# EAGLE design OBCv4.21 (EAGLE 9.6.2)

## Sheet 1 of 3
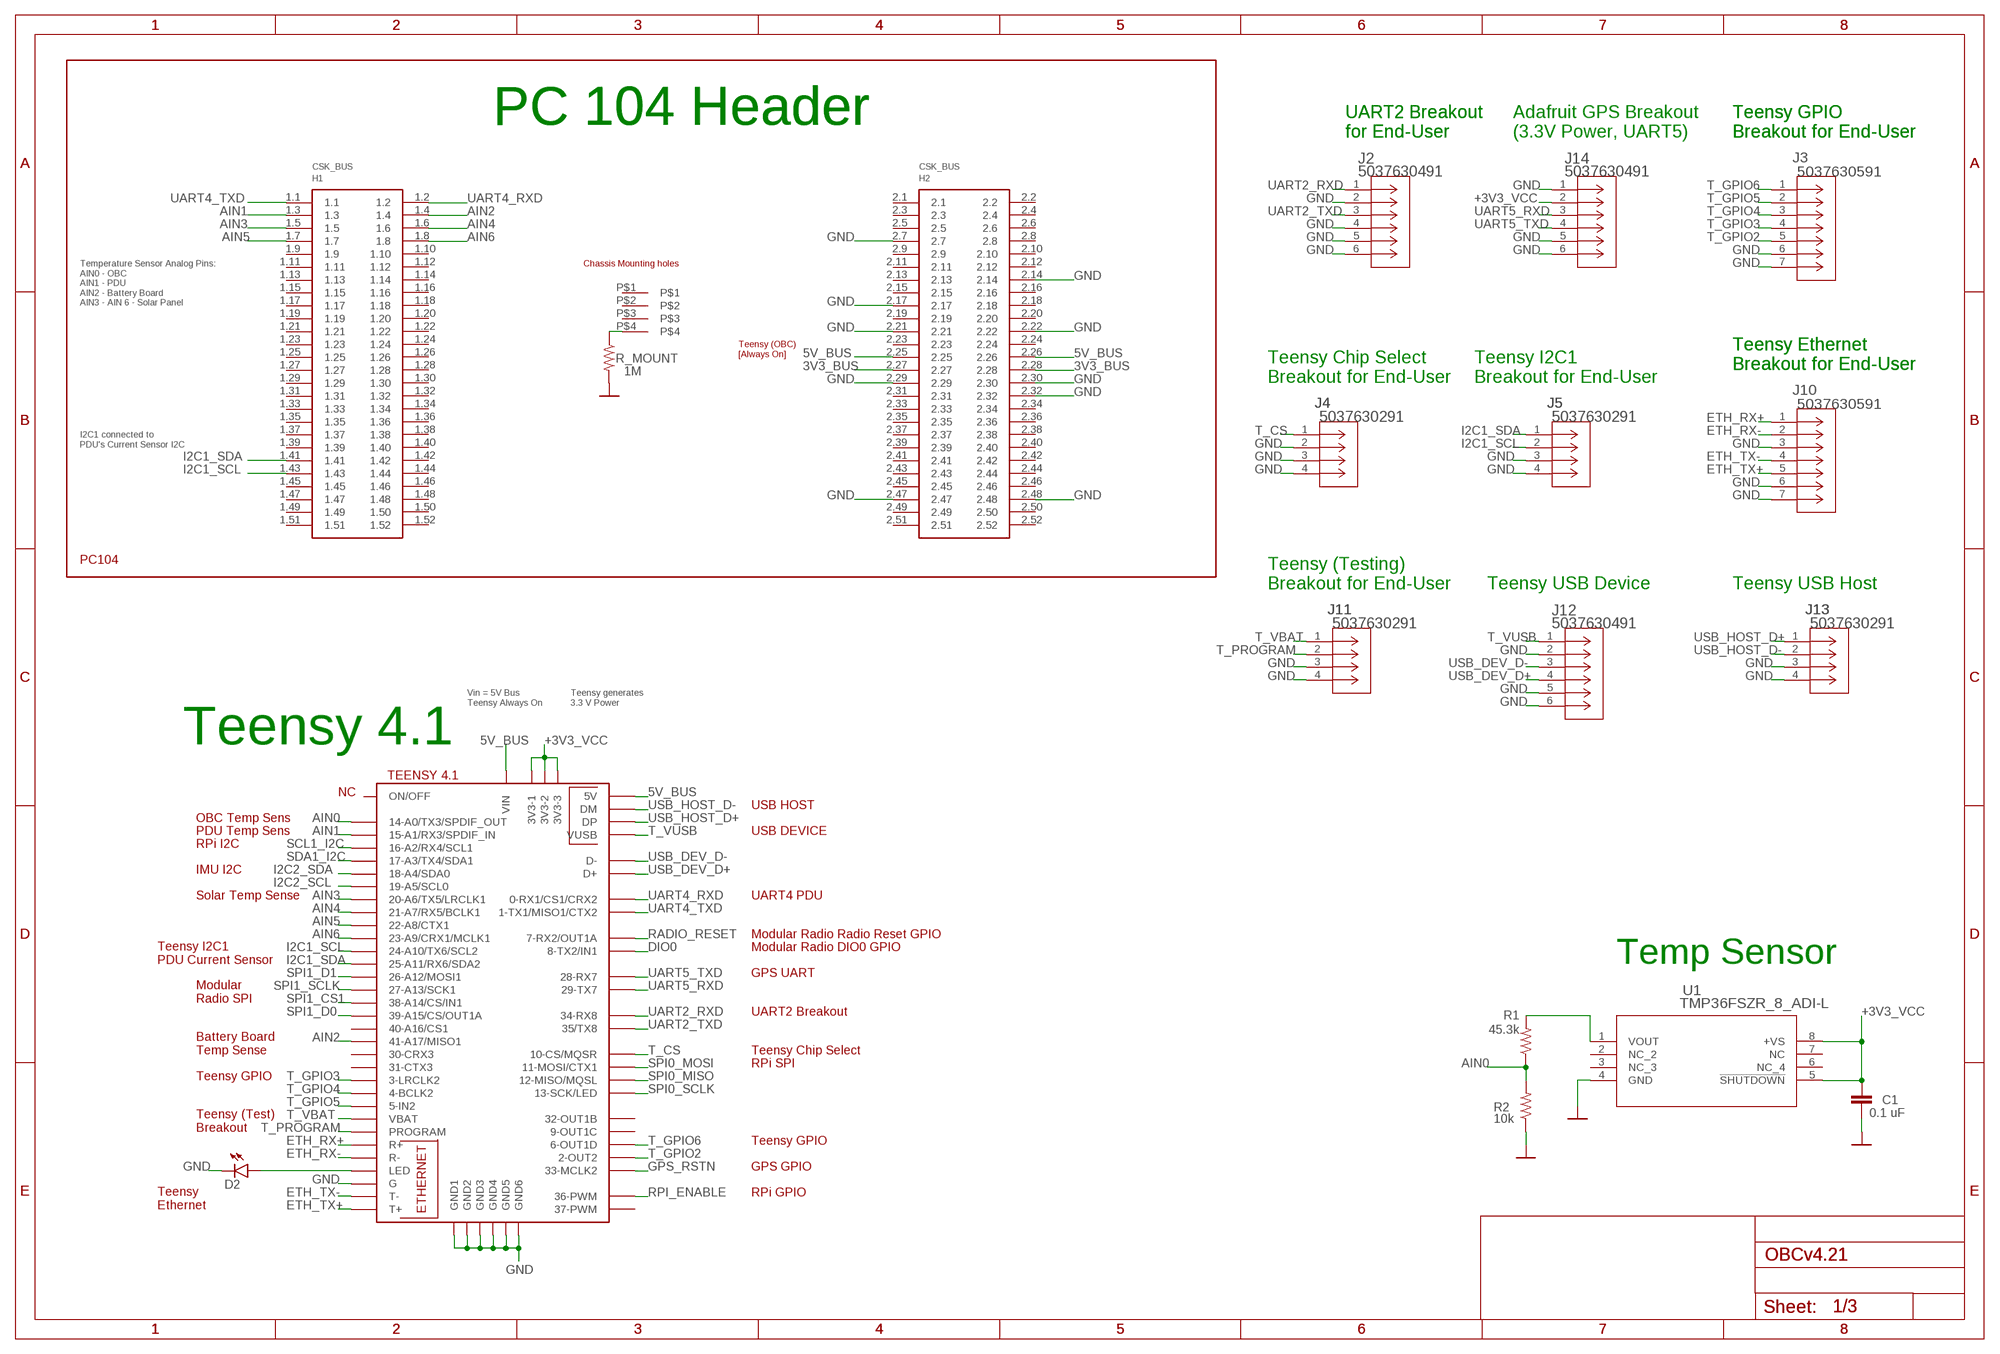
[diagram p0: schematic, sheet 1]

### Parts
C1  0.1 uF  CAP0805  [0805]
D2  LEDCHIP-LED0603  [CHIP-LED0603]
H1  PC104_WCONN  [PC104_WCONN]
J2  5037630491  [CON_5037630491]
J3  5037630591  [CON_5037630591]
J4  5037630291  [CON_5037630291]
J5  5037630291  [CON_5037630291]
J10  5037630591  [CON_5037630591]
J11  5037630291  [CON_5037630291]
J12  5037630491  [CON_5037630491]
J13  5037630291  [CON_5037630291]
J14  5037630491  [CON_5037630491]
R1  45.3k  RESISTOR0805-RES  [0805]
R2  10k  RESISTOR0805-RES  [0805]
R_MOUNT  1M  RESISTOR0805-RES  [0805]
U1  TMP36FSZR_8_ADI-L  [R_8_ADI-L]
U$1  TEENSY41  [TEENSY41]

### Nets
3V3_BUS: H1.2.27 H1.2.28 ; also sheet 3
5V_BUS: H1.2.25 H1.2.26 U$1.+5V(5V) U$1.VIN ; also sheet 2
+3V3_VCC: C1.1 J14.2 U1.5(!SHUTDOWN) U1.8(+VS) U$1.3V3-1 U$1.3V3-2 U$1.3V3-3 ; also sheet 3
AIN0: R1.1 R2.2 U$1.14-A0/TX3/SPDIF_OUT
AIN1: H1.1.3 U$1.15-A1/RX3/SPDIF_IN
AIN2: H1.1.4 U$1.41-A17/MISO1
AIN3: H1.1.5 U$1.20-A6/TX5/LRCLK1
AIN4: H1.1.6 U$1.21-A7/RX5/BCLK1
AIN5: H1.1.7 U$1.22-A8/CTX1
AIN6: H1.1.8 U$1.23-A9/CRX1/MCLK1
DIO0: U$1.8-TX2/IN1 ; also sheet 3
ETH_RX+: J10.1 U$1.R+
ETH_RX-: J10.2 U$1.R-
ETH_TX+: J10.5 U$1.T+
ETH_TX-: J10.4 U$1.T-
GND: C1.2 D2.C H1.2.7 H1.2.14 H1.2.17 H1.2.21 H1.2.22 H1.2.29 H1.2.30 H1.2.32 H1.2.47 H1.2.48 J2.2 J2.4 J2.5 J2.6 J3.6 J3.7 J4.2 J4.3 J4.4 J5.3 J5.4 J10.3 J10.6 J10.7 J11.3 J11.4 J12.2 J12.5 J12.6 J13.3 J13.4 J14.1 J14.5 J14.6 R2.1 R_MOUNT.2 U1.4(GND) U$1.G U$1.GND1 U$1.GND2 U$1.GND3 U$1.GND4 U$1.GND5 U$1.GND6 ; also sheet 2,3
GPS_RSTN: U$1.33-MCLK2 ; also sheet 3
I2C1_SCL: H1.1.43 J5.2 U$1.24-A10/TX6/SCL2
I2C1_SDA: H1.1.41 J5.1 U$1.25-A11/RX6/SDA2
I2C2_SCL: U$1.19-A5/SCL0 ; also sheet 3
I2C2_SDA: U$1.18-A4/SDA0 ; also sheet 3
N$8: D2.A U$1.LED
N$15: R1.2 U1.1(VOUT)
N$94: H1.P$4 R_MOUNT.1
RADIO_RESET: U$1.7-RX2/OUT1A ; also sheet 3
RPI_ENABLE: U$1.36-PWM ; also sheet 2
SCL1_I2C: U$1.16-A2/RX4/SCL1 ; also sheet 2
SDA1_I2C: U$1.17-A3/TX4/SDA1 ; also sheet 2
SPI0_MISO: U$1.12-MISO/MQSL ; also sheet 2
SPI0_MOSI: U$1.11-MOSI/CTX1 ; also sheet 2
SPI0_SCLK: U$1.13-SCK/LED ; also sheet 2
SPI1_CS1: U$1.38-A14/CS/IN1 ; also sheet 3
SPI1_D0: U$1.39-A15/CS/OUT1A ; also sheet 3
SPI1_D1: U$1.26-A12/MOSI1 ; also sheet 3
SPI1_SCLK: U$1.27-A13/SCK1 ; also sheet 3
T_CS: J4.1 U$1.10-CS\MQSR(10-CS/MQSR)
T_GPIO2: J3.5 U$1.2-OUT2
T_GPIO3: J3.4 U$1.3-LRCLK2
T_GPIO4: J3.3 U$1.4-BCLK2
T_GPIO5: J3.2 U$1.5-IN2
T_GPIO6: J3.1 U$1.6-OUT1D
T_PROGRAM: J11.2 U$1.PROGRAM
T_VBAT: J11.1 U$1.VBAT
T_VUSB: J12.1 U$1.VUSB
UART2_RXD: J2.1 U$1.34-RX8
UART2_TXD: J2.3 U$1.35-TX8(35/TX8)
UART4_RXD: H1.1.2 U$1.0-RX1/CS1/CRX2
UART4_TXD: H1.1.1 U$1.1-TX1/MISO1/CTX2
UART5_RXD: J14.3 U$1.29-TX7 ; also sheet 3
UART5_TXD: J14.4 U$1.28-RX7 ; also sheet 3
USB_DEV_D+: J12.4 U$1.D+
USB_DEV_D-: J12.3 U$1.D-
USB_HOST_D+: J13.1 U$1.DP
USB_HOST_D-: J13.2 U$1.DM
Unconnected: H1.1.9 H1.1.10 H1.1.11 H1.1.12 H1.1.13 H1.1.14 H1.1.15 H1.1.16 H1.1.17 H1.1.18 H1.1.19 H1.1.20 H1.1.21 H1.1.22 H1.1.23 H1.1.24 H1.1.25 H1.1.26 H1.1.27 H1.1.28 H1.1.29 H1.1.30 H1.1.31 H1.1.32 H1.1.33 H1.1.34 H1.1.35 H1.1.36 H1.1.37 H1.1.38 H1.1.39 H1.1.40 H1.1.42 H1.1.44 H1.1.45 H1.1.46 H1.1.47 H1.1.48 H1.1.49 H1.1.50 H1.1.51 H1.1.52 H1.2.1 H1.2.2 H1.2.3 H1.2.4 H1.2.5 H1.2.6 H1.2.8 H1.2.9 H1.2.10 H1.2.11 H1.2.12 H1.2.13 H1.2.15 H1.2.16 H1.2.18 H1.2.19 H1.2.20 H1.2.23 H1.2.24 H1.2.31 H1.2.33 H1.2.34 H1.2.35 H1.2.36 H1.2.37 H1.2.38 H1.2.39 H1.2.40 H1.2.41 H1.2.42 H1.2.43 H1.2.44 H1.2.45 H1.2.46 H1.2.49 H1.2.50 H1.2.51 H1.2.52 H1.P$1 H1.P$2 H1.P$3 U1.2(NC_2) U1.3(NC_3) U1.6(NC_4) U1.7(NC) U$1.9-OUT1C U$1.30-CRX3 U$1.31-CTX3 U$1.32-OUT1B U$1.37-PWM U$1.40-A16/CS1 U$1.ON/OFF

### Notes on the sheet
- PC 104 Header | PC 104 Header
- UART2 Breakout
  for End-User
- UART2 Breakout
  for End-User
- Adafruit GPS Breakout 
  (3.3V Power, UART5)
- Teensy GPIO
  Breakout for End-User
- Teensy GPIO
  Breakout for End-User
- Temperature Sensor Analog Pins:
  AIN0 - OBC
  AIN1 - PDU
  AIN2 - Battery Board
  AIN3 - AIN 6 - Solar Panel
- Teensy (OBC)
  [Always On]
- Teensy Ethernet
  Breakout for End-User
- Teensy Ethernet
  Breakout for End-User
- Teensy Chip Select
  Breakout for End-User
- Teensy I2C1 
  Breakout for End-User
- I2C1 connected to
  PDU's Current Sensor I2C
- Teensy (Testing)
  Breakout for End-User
- Teensy USB Device | Teensy USB Host
- Vin = 5V Bus 
  Teensy Always On
- Teensy generates 
  3.3 V Power
- Teensy 4.1
- NC
- USB HOST
- OBC Temp Sens
- PDU Temp Sens | USB DEVICE
- RPi I2C
- IMU I2C
- Solar Temp Sense | UART4 PDU
- Modular Radio Radio Reset GPIO
- Modular Radio DIO0 GPIO
- Teensy I2C1
  PDU Current Sensor
- Temp Sensor
- GPS UART
- Modular 
  Radio SPI
- UART2 Breakout
- Battery Board
  Temp Sense
- Teensy Chip Select
- RPi SPI
- Teensy GPIO
- Teensy (Test)
  Breakout
- Teensy GPIO
- GPS GPIO
- RPi GPIO
- Teensy 
  Ethernet

## Sheet 2 of 3
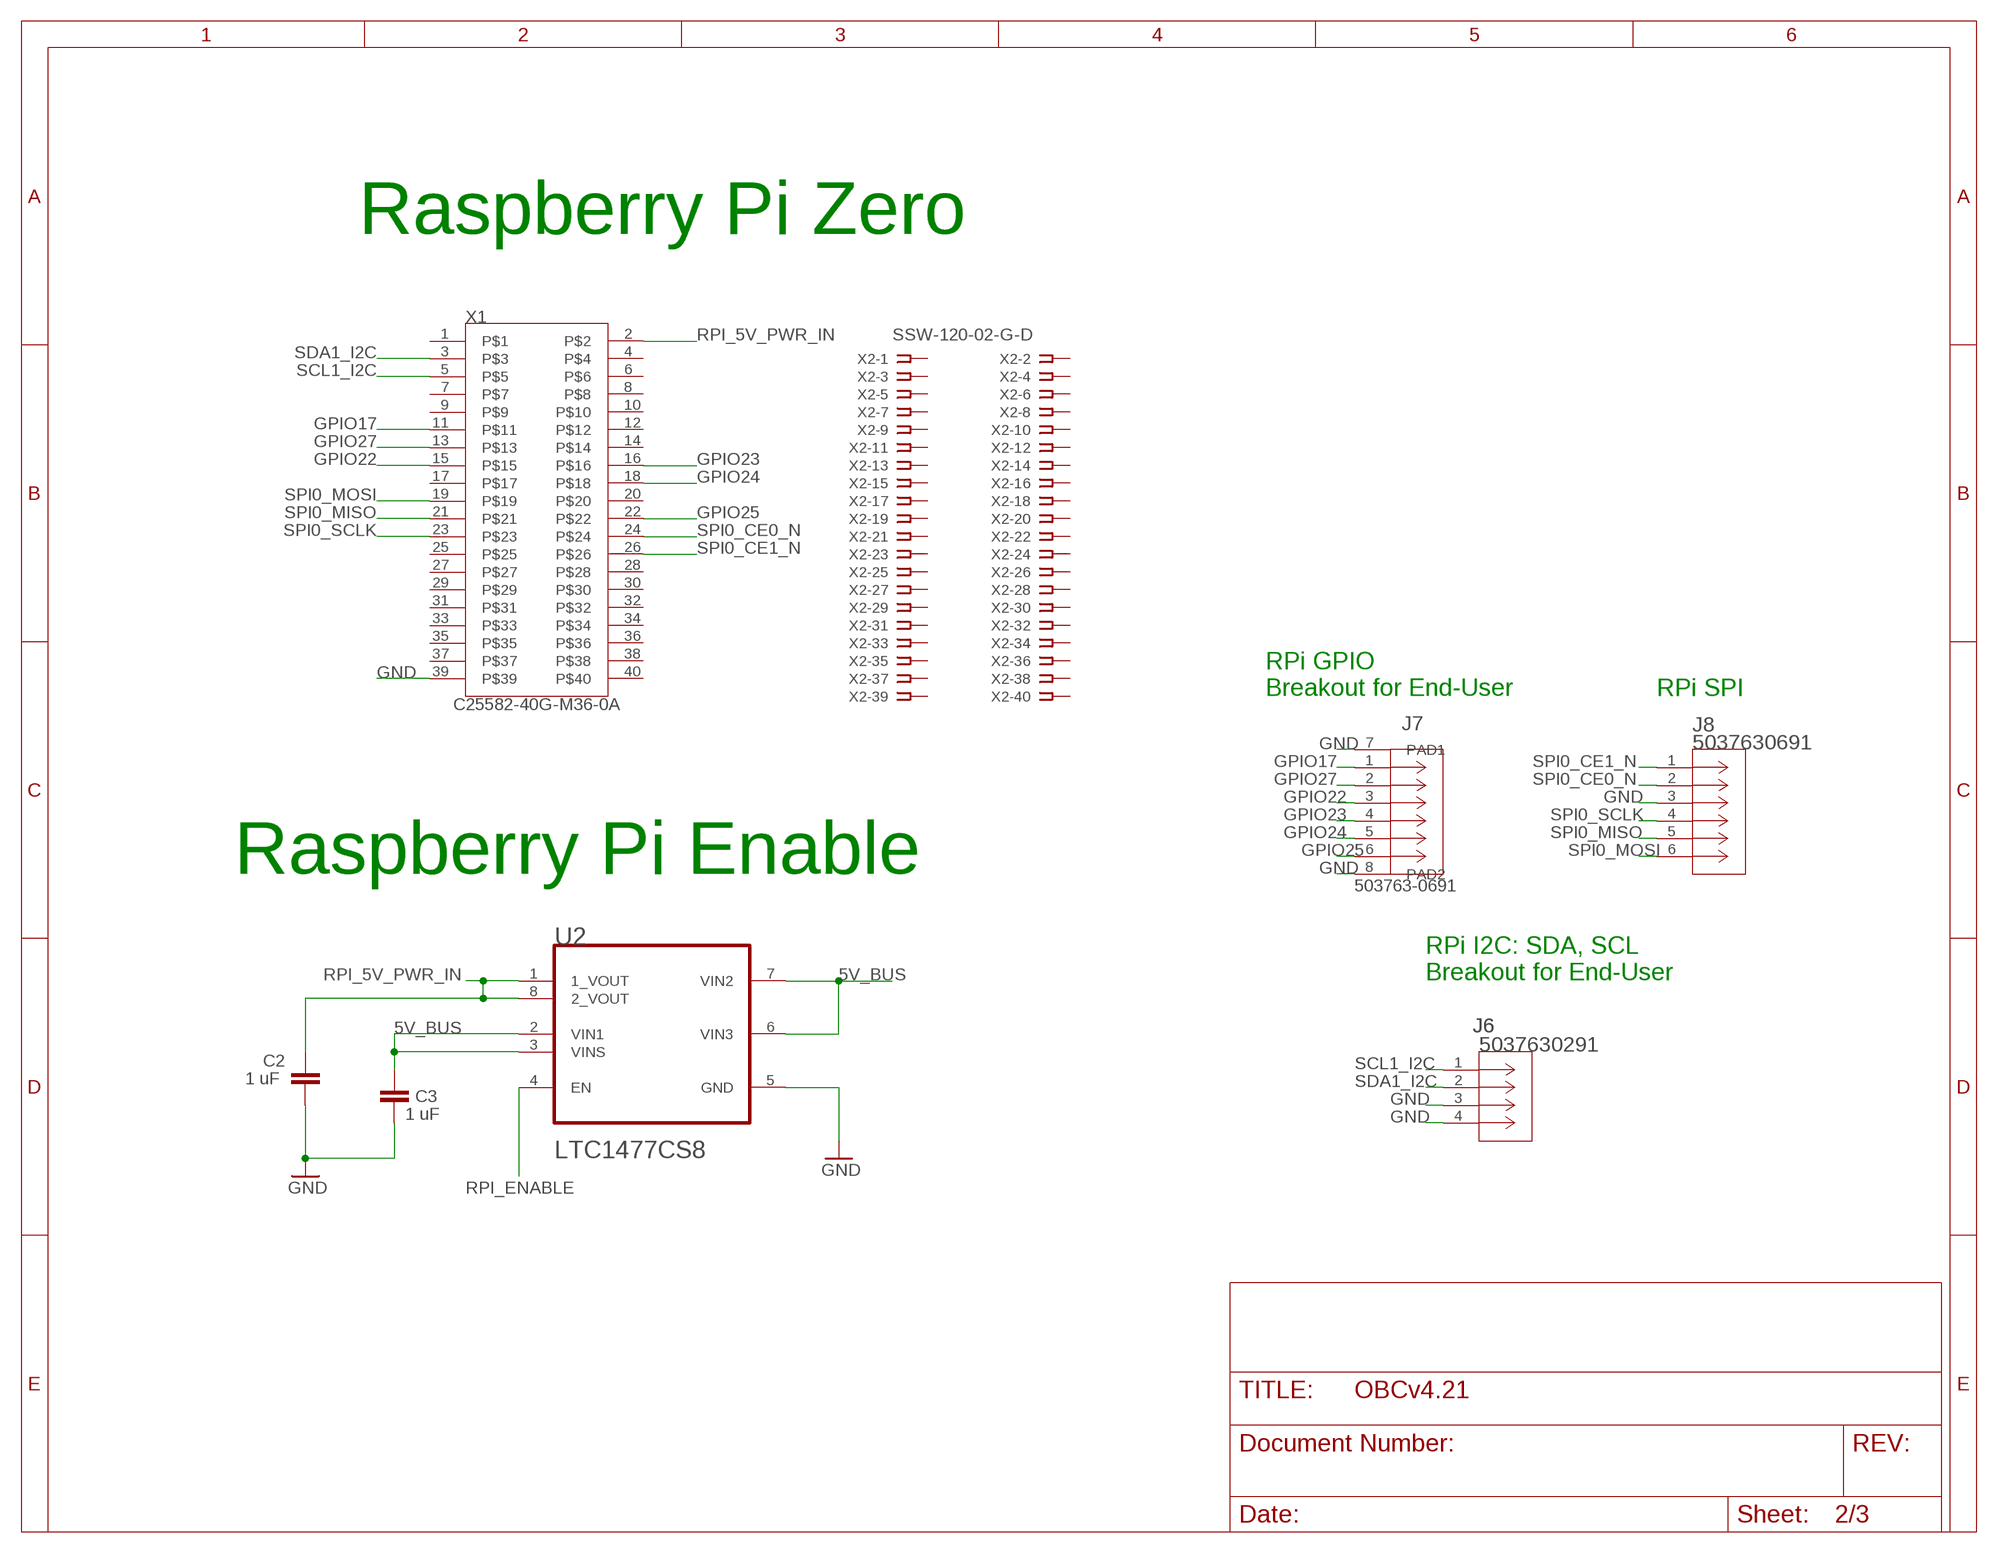
[diagram p1: schematic, sheet 2]

### Parts
C2  1 uF  CAP0805  [0805]
C3  1 uF  CAP0805  [0805]
J6  5037630291  [CON_5037630291]
J7  503763-0691  [CONN_503763-0691_MOL]
J8  5037630691  [CONN_503763-0691_MOL]
U2  LTC1477CS8LINEAR_TECHNOLOGY_LTC1477CS8_0_2  [LINEAR_TECHNOLOGY_LTC1477CS8_2]
X1  C25582-40G-M36-0A  [ADAFRUIT_C25582-40G-M36-0A_0]
X2  SSW-120-02-G-D  [SSW-120-02-G-D]

### Nets
5V_BUS: C3.1 U2.2(VIN1) U2.3(VINS) U2.6(VIN3) U2.7(VIN2) ; also sheet 1
GND: C2.2 C3.2 J6.3 J6.4 J7.7(PAD1) J7.8(PAD2) J8.3 U2.5(GND) X1.39 ; also sheet 1,3
GPIO17: J7.1 X1.11
GPIO22: J7.3 X1.15
GPIO23: J7.4 X1.16
GPIO24: J7.5 X1.18
GPIO25: J7.6 X1.22
GPIO27: J7.2 X1.13
RPI_5V_PWR_IN: C2.1 U2.1(1_VOUT) U2.8(2_VOUT) X1.2
RPI_ENABLE: U2.4(EN) ; also sheet 1
SCL1_I2C: J6.1 X1.5 ; also sheet 1
SDA1_I2C: J6.2 X1.3 ; also sheet 1
SPI0_CE0_N: J8.2 X1.24
SPI0_CE1_N: J8.1 X1.26
SPI0_MISO: J8.5 X1.21 ; also sheet 1
SPI0_MOSI: J8.6 X1.19 ; also sheet 1
SPI0_SCLK: J8.4 X1.23 ; also sheet 1
Unconnected: X1.1 X1.4 X1.6 X1.7 X1.8 X1.9 X1.10 X1.12 X1.14 X1.17 X1.20 X1.25 X1.27 X1.28 X1.29 X1.30 X1.31 X1.32 X1.33 X1.34 X1.35 X1.36 X1.37 X1.38 X1.40 X2.1 X2.2 X2.3 X2.4 X2.5 X2.6 X2.7 X2.8 X2.9 X2.10 X2.11 X2.12 X2.13 X2.14 X2.15 X2.16 X2.17 X2.18 X2.19 X2.20 X2.21 X2.22 X2.23 X2.24 X2.25 X2.26 X2.27 X2.28 X2.29 X2.30 X2.31 X2.32 X2.33 X2.34 X2.35 X2.36 X2.37 X2.38 X2.39 X2.40

### Notes on the sheet
- Raspberry Pi Zero
- RPi GPIO
  Breakout for End-User
- RPi SPI
- Raspberry Pi Enable
- RPi I2C: SDA, SCL 
  Breakout for End-User

## Sheet 3 of 3
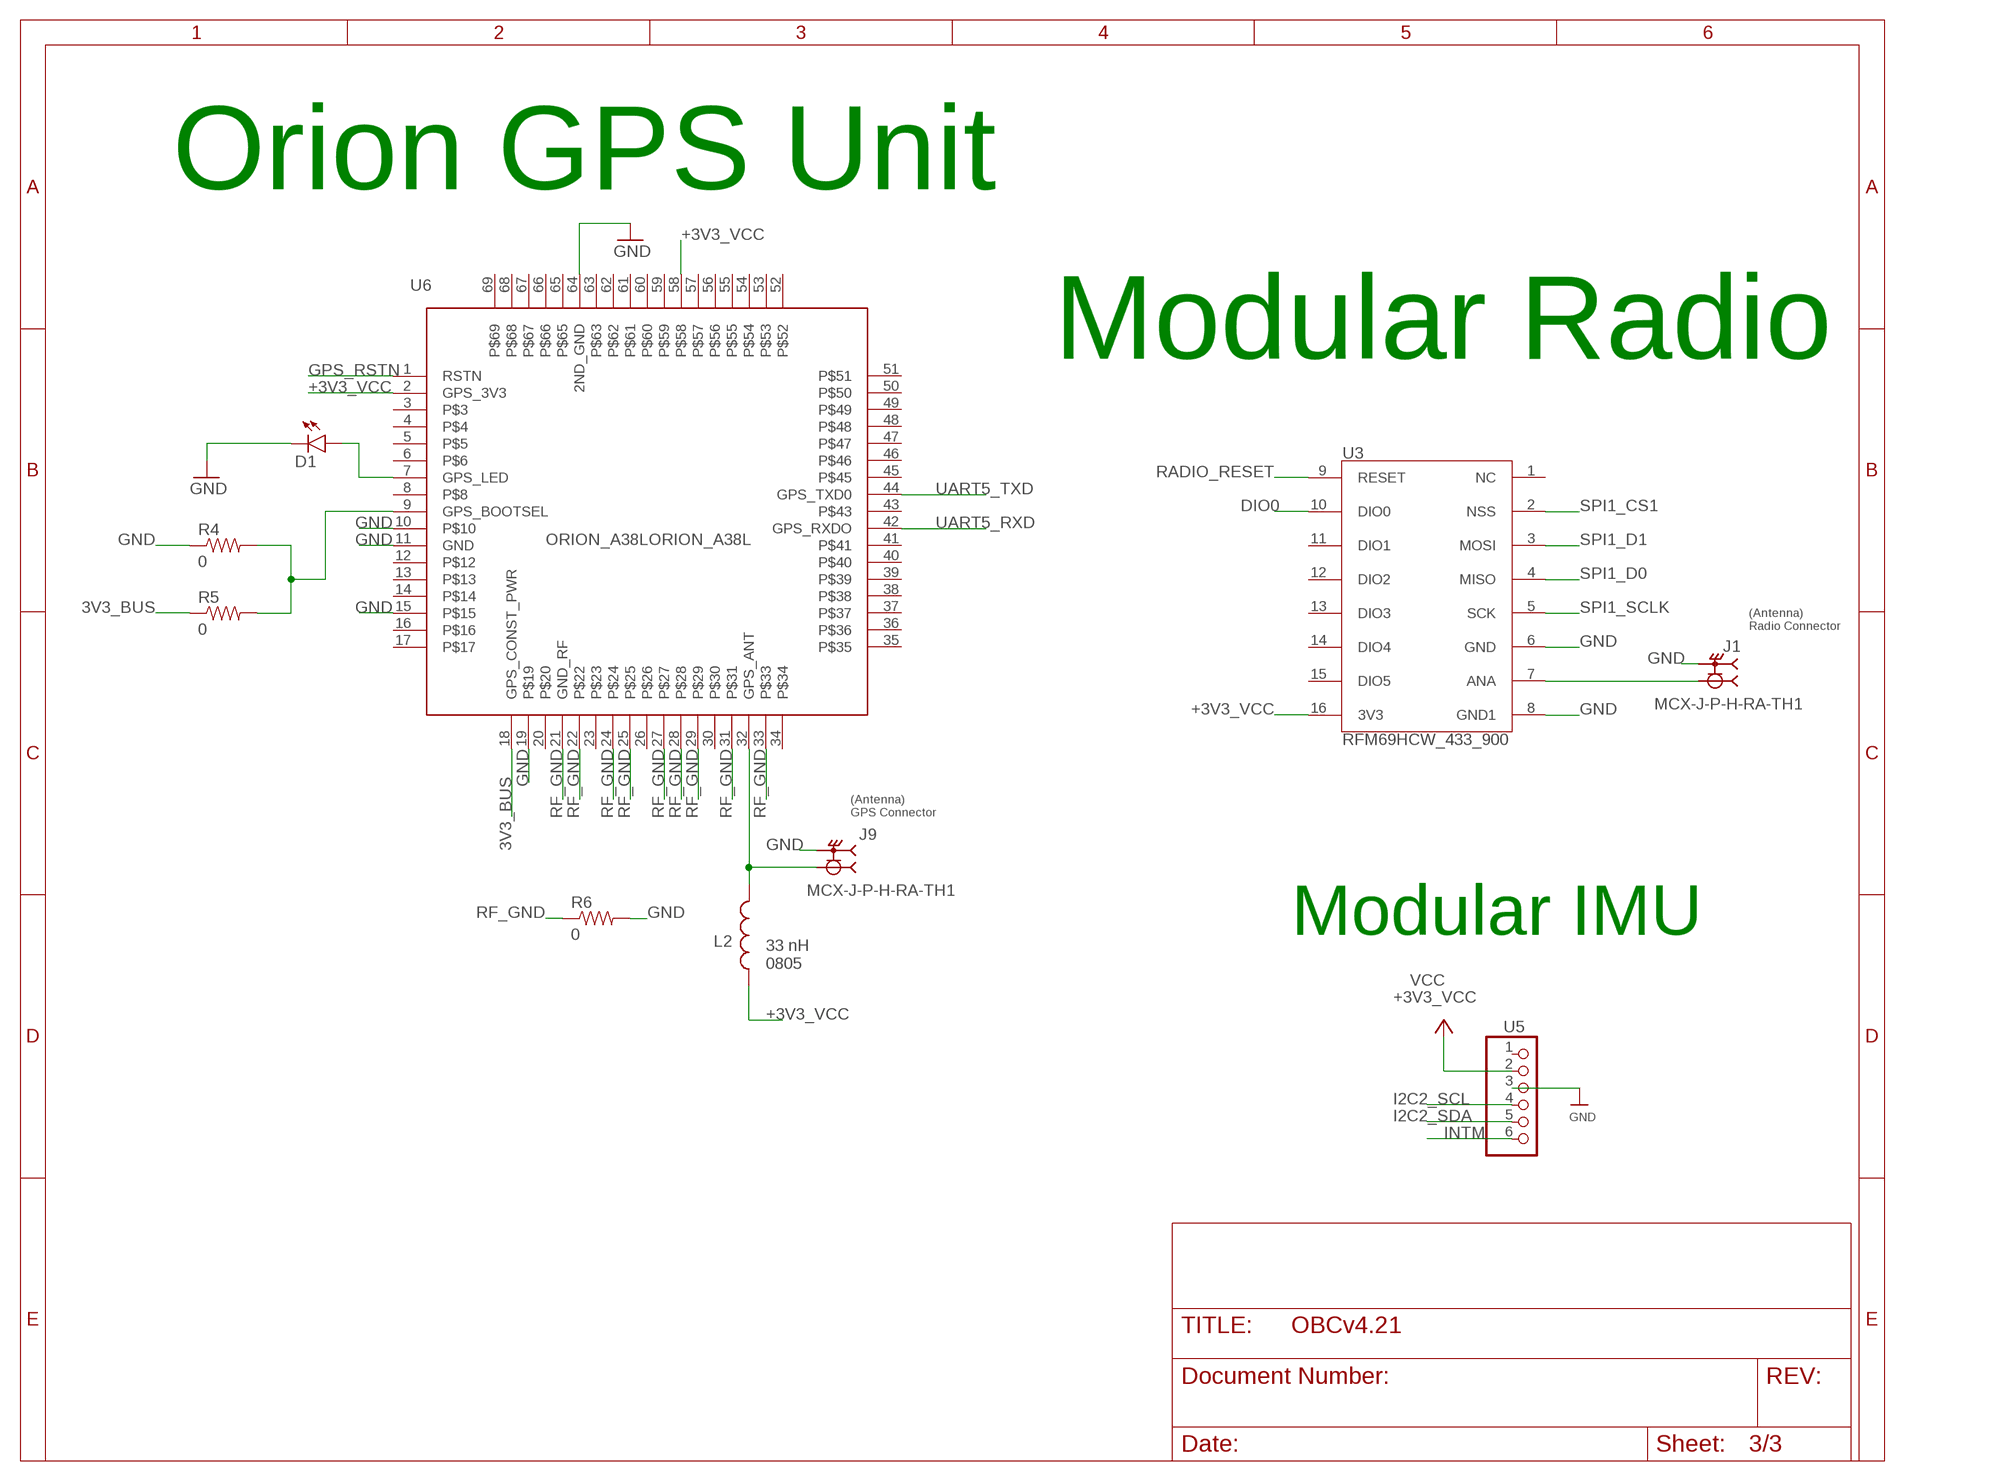
[diagram p2: schematic, sheet 3]

### Parts
D1  LEDCHIP-LED0603  [CHIP-LED0603]
J1  MCX-J-P-H-RA-TH1  [SAMTEC_MCX-J-P-H-RA-TH1]
J9  MCX-J-P-H-RA-TH1  [SAMTEC_MCX-J-P-H-RA-TH1]
L2  AIMC-0805-2N2S-T  [INDC2012X105N]
R4  0  RESISTOR0805-RES  [0805]
R5  0  RESISTOR0805-RES  [0805]
R6  0  RESISTOR0805-RES  [0805]
U3  RFM69HCW_433_900  [RFM69HCW_433]
U5  HEADER-1X670MIL  [1X06_ROUND_70]
U6  ORION_A38LORION_A38L  [ORION_A38L]

### Nets
3V3_BUS: R5.1 U6.18(GPS_CONST_PWR) ; also sheet 1
+3V3_VCC: L2.1 U3.16(3V3) U5.2 U6.2(GPS_3V3) U6.58 ; supply symbol labelled VCC ; also sheet 1
DIO0: U3.10(DIO0) ; also sheet 1
GND: D1.C J1.S1 J1.S2 J1.S3 J1.S4 J9.S1 J9.S2 J9.S3 J9.S4 R4.1 R6.2 U3.6(GND) U3.8(GND1) U5.3 U6.10 U6.11(GND) U6.15 U6.19 U6.64(2ND_GND) ; also sheet 1,2
GPS_RSTN: U6.1(RSTN) ; also sheet 1
I2C2_SCL: U5.4 ; also sheet 1
I2C2_SDA: U5.5 ; also sheet 1
INTM: U5.6
N$12: J1.1 U3.7(ANA)
N$16: R4.2 R5.2 U6.9(GPS_BOOTSEL)
N$17: J9.1 L2.2 U6.32(GPS_ANT)
N$21: D1.A U6.7(GPS_LED)
RADIO_RESET: U3.9(RESET) ; also sheet 1
RF_GND: R6.1 U6.21(GND_RF) U6.22 U6.24 U6.25 U6.27 U6.28 U6.29 U6.31 U6.33
SPI1_CS1: U3.2(NSS) ; also sheet 1
SPI1_D0: U3.4(MISO) ; also sheet 1
SPI1_D1: U3.3(MOSI) ; also sheet 1
SPI1_SCLK: U3.5(SCK) ; also sheet 1
UART5_RXD: U6.42(GPS_RXDO) ; also sheet 1
UART5_TXD: U6.44(GPS_TXD0) ; also sheet 1
Unconnected: U3.1(NC) U3.11(DIO1) U3.12(DIO2) U3.13(DIO3) U3.14(DIO4) U3.15(DIO5) U5.1 U6.3 U6.4 U6.5 U6.6 U6.8 U6.12 U6.13 U6.14 U6.16 U6.17 U6.20 U6.23 U6.26 U6.30 U6.34 U6.35 U6.36 U6.37 U6.38 U6.39 U6.40 U6.41 U6.43 U6.45 U6.46 U6.47 U6.48 U6.49 U6.50 U6.51 U6.52 U6.53 U6.54 U6.55 U6.56 U6.57 U6.59 U6.60 U6.61 U6.62 U6.63 U6.65 U6.66 U6.67 U6.68 U6.69

### Notes on the sheet
- Orion GPS Unit
- Modular Radio
- (Antenna)
  Radio Connector
- (Antenna)
  GPS Connector
- Modular IMU
- 33 nH
  0805

## Library data of the parts
C1-C3 = HSFL_Main_Library:CAP: Capacitor Standard 0603 ceramic capacitor, and 0.1" leaded capacitor.
D1 D2 = led:LED: LED OSRAM: - CHIPLED LG R971, LG N971, LY N971, LG Q971, LY Q971, LO R971, LY R971 LH N974, LH R974 LS Q976, LO Q976, LY Q976 LO Q996 - Hyper CHIPLED LW Q18S LB Q993, LB Q99A, LB R99A - SideLED LS A670, LO A670, LY A670, LG A670, LP A670 LB A673, LV A673, LT A673, LW A673 LH A674 LY A675 LS A676, LA A676, LO A676, LY A676, LW A676 LS A679, LY A679, LG A679 - Hyper Micro SIDELED® LS Y876, LA Y876, LO Y876, LY Y876 LT Y87S - SmartLED LW L88C, LW L88S LB L89C, LB L89S, LG L890 LS L89K, LO L89K, LY L89K LS L896, LA L896, LO L896, LY L896 - TOPLED LS T670, LO T670, LY T670, LG T670, LP T670 LSG T670, LSP T670, LSY T670, LOP T670, LYG T670 LG T671, LOG T671, LSG T671 LB T673, LV T673, LT T673, LW T673 LH T674 LS T676, LA T676, LO T676, LY T676, LB T676, LH T676, LSB T676, LW T676 LB T67C, LV T67C, LT T67C, LS T67K, LO T67K, LY T67K, LW E67C LS E67B, LA E67B, LO E67B, LY E67B, LB E67C, LV E67C, LT E67C LW T67C LS T679, LY T679, LG T679 LS T770, LO T770, LY T770, LG T770, LP T770 LB T773, LV T773, LT T773, LW T773 LH T774 LS E675, LA E675, LY E675, LS T675 LS T776, LA T776, LO T776, LY T776, LB T776 LHGB T686 LT T68C, LB T68C - Hyper Mini TOPLED® LB M676 - Mini TOPLED Santana® LG M470 LS M47K, LO M47K, LY M47K Source: http://www.osram.convergy.de LUXEON: - LUMILED® LXK2-PW12-R00, LXK2-PW12-S00, LXK2-PW14-U00, LXK2-PW14-V00 LXK2-PM12-R00, LXK2-PM12-S00, LXK2-PM14-U00 LXK2-PE12-Q00, LXK2-PE12-R00, LXK2-PE12-S00, LXK2-PE14-T00, LXK2-PE14-U00 LXK2-PB12-K00, LXK2-PB12-L00, LXK2-PB12-M00, LXK2-PB14-N00, LXK2-PB14-P00, LXK2-PB14-Q00 LXK2-PR12-L00, LXK2-PR12-M00, LXK2-PR14-Q00, LXK2-PR14-R00 LXK2-PD12-Q00, LXK2-PD12-R00, LXK2-PD12-S00 LXK2-PH12-R00, LXK2-PH12-S00 LXK2-PL12-P00, LXK2-PL12-Q00, LXK2-PL12-R00 Source: www.luxeon.com KINGBRIGHT: KA-3528ASYC Source: www.kingbright.com
H1 = HSFL_Main_Library:PC104_WCONN
J1 J9 = OBCv4:MCX-J-P-H-RA-TH1: 50 Ohm MCX Jack or Plug, Through-hole; DESCRIPTION: MCX Connector Jack, Female Socket 50Ohm Through Hole, Right Angle Solder; DIGI-KEY_PART_NUMBER: SAM10607-ND; MF: Samtec; MP: MCX-J-P-H-RA-TH1; PACKAGE: None; PURCHASE-URL: https://pricing.snapeda.com/search/part/MCX-J-P-H-RA-TH1/?ref=eda
J2 J12 J14 = OBCv4:5037630491; BUILT_BY: Molex_Team; COPYRIGHT: Copyright (C) 2018 Accelerated Designs. All rights reserved; MANUFACTURER_PART_NUMBER: 5037630491; SOURCELIBRARY: Add_to_database_2021-03-17; VENDOR: Molex Connector Corporation
J3 J10 = OBCv4:5037630591; COPYRIGHT: Copyright (C) 2021 Ultra Librarian. All rights reserved.; MANUFACTURER_PART_NUMBER: 5037630591; MFR_NAME: Molex Connector Corporation
J4-J6 J11 J13 = OBCv4:5037630291; BUILT_BY: Molex_Team; COPYRIGHT: Copyright (C) 2018 Accelerated Designs. All rights reserved; MANUFACTURER_PART_NUMBER: 5037630291; SOURCELIBRARY: Add_to_database_2021-03-17; VENDOR: Molex Connector Corporation
J7 = Improved Molex 503763-0691:503763-0691; BUILT_BY: EMA_Cory; COPYRIGHT: Copyright (C) 2018 Accelerated Designs. All rights reserved; DATASHEET: https://www.digikey.com/products/en?keywords=503763-0691; MANUFACTURER_PART_NUMBER: 503763-0691; SOURCELIBRARY: Molex_2020-01-22; VENDOR: Molex Connector Corporation
J8 = OBCv4:5037630691; BUILT_BY: EMA_Cory; COPYRIGHT: Copyright (C) 2018 Accelerated Designs. All rights reserved; DATASHEET: https://www.digikey.com/products/en?keywords=503763-0691; MANUFACTURER_PART_NUMBER: 503763-0691; SOURCELIBRARY: Molex_2020-01-22; VENDOR: Molex Connector Corporation
L2 = PDU:AIMC-0805-2N2S-T: 2.2nH Unshielded Multilayer Inductor 600mA 100mOhm Max 0805 (2012 Metric); DESCRIPTION: IND 2.2nH 0.3A 100mΩ; DIGI-KEY_PART_NUMBER: 535-11562-1-ND; MF: Abracon; MP: AIMC-0805-2N2S-T; PACKAGE: 2012 Bourns
R1 R2 R4-R6 R_MOUNT = HSFL_Main_Library:RESISTOR: Resistor Basic schematic elements and footprints for 0603, 1206, and PTH resistors.
U1 = TMP36FSZR_8:TMP36FSZ; COPYRIGHT: Copyright (C) 2021 Ultra Librarian. All rights reserved.; MANUFACTURER_PART_NUMBER: TMP36FSZ; MFR_NAME: Analog Devices Inc
U2 = Artemis:LTC1477CS8: LT-LTC1477-S8-8; CIIVA_IDS: 1432281; COMPONENT_LINK_1_DESCRIPTION: Manufacturer URL; COMPONENT_LINK_1_URL: http://www.linear.com/; COMPONENT_LINK_3_DESCRIPTION: Package Specification; COMPONENT_LINK_3_URL: http://cds.linear.com/docs/en/packaging/05081610_G_SO8.pdf; DATASHEET: http://cds.linear.com/docs/en/datasheet/lt1477.pdf; FOOTPRINT_VARIANT_NAME_0: Level C; FOOTPRINT_VARIANT_NAME_1: Level B; FOOTPRINT_VARIANT_NAME_2: Level A; IMPORTED: yes; IMPORTED_FROM: vault; IMPORT_TS: 1521843574; MF: Linear Technology; MOUNTING_TECHNOLOGY: Surface Mount; MPN: LTC1477CS8; PACKAGE: S8-8; PACKAGE_DESCRIPTION: 8-Pin Plastic Small Outline (Narrow .150 Inch), Body 4.9 x 3.9 mm, Pitch 1.27 mm; PACKAGE_VERSION: Rev. G, 03/2012; PREFIX: U; RELEASE_DATE: 1377817843; ROHS: No; VAULT_GUID: 635B2D7C-EC07-409E-A57F-666E02CD64AC; VAULT_REVISION: 6B8B57C2-2CB3-4970-A31A-1EB58B636423
U3 = RFM69HCW:RFM69HCW_433_900: Rfm69hcw Wireless Transceiver 91 Check prices <https://pricing.snapeda.com/parts/RFM69HCW-315S2/HOPERF/view-part?ref=eda>
U5 = microbuilder:HEADER-1X6: PIN HEADER
U6 = Artemis:ORION_A38L
U$1 = OBCv4:TEENSY41
X1 = Adafruit - C25582-40G-M36-0A:C25582-40G-M36-0A
X2 = con-samtec-edited:SSW-120-02-G: THROUGH-HOLE .025" SQ POST SOCKET Source: Samtec SSW.pdf; MF: Samtec Inc.; MPN: SSW-120-02-G-D; OC_FARNELL: unknown; OC_NEWARK: 11P9639

## Net classes
1 highpower: width 0.406 mm, drill 0.483 mm
2 lowpower: width 0.305 mm, drill 0.483 mm

## Board
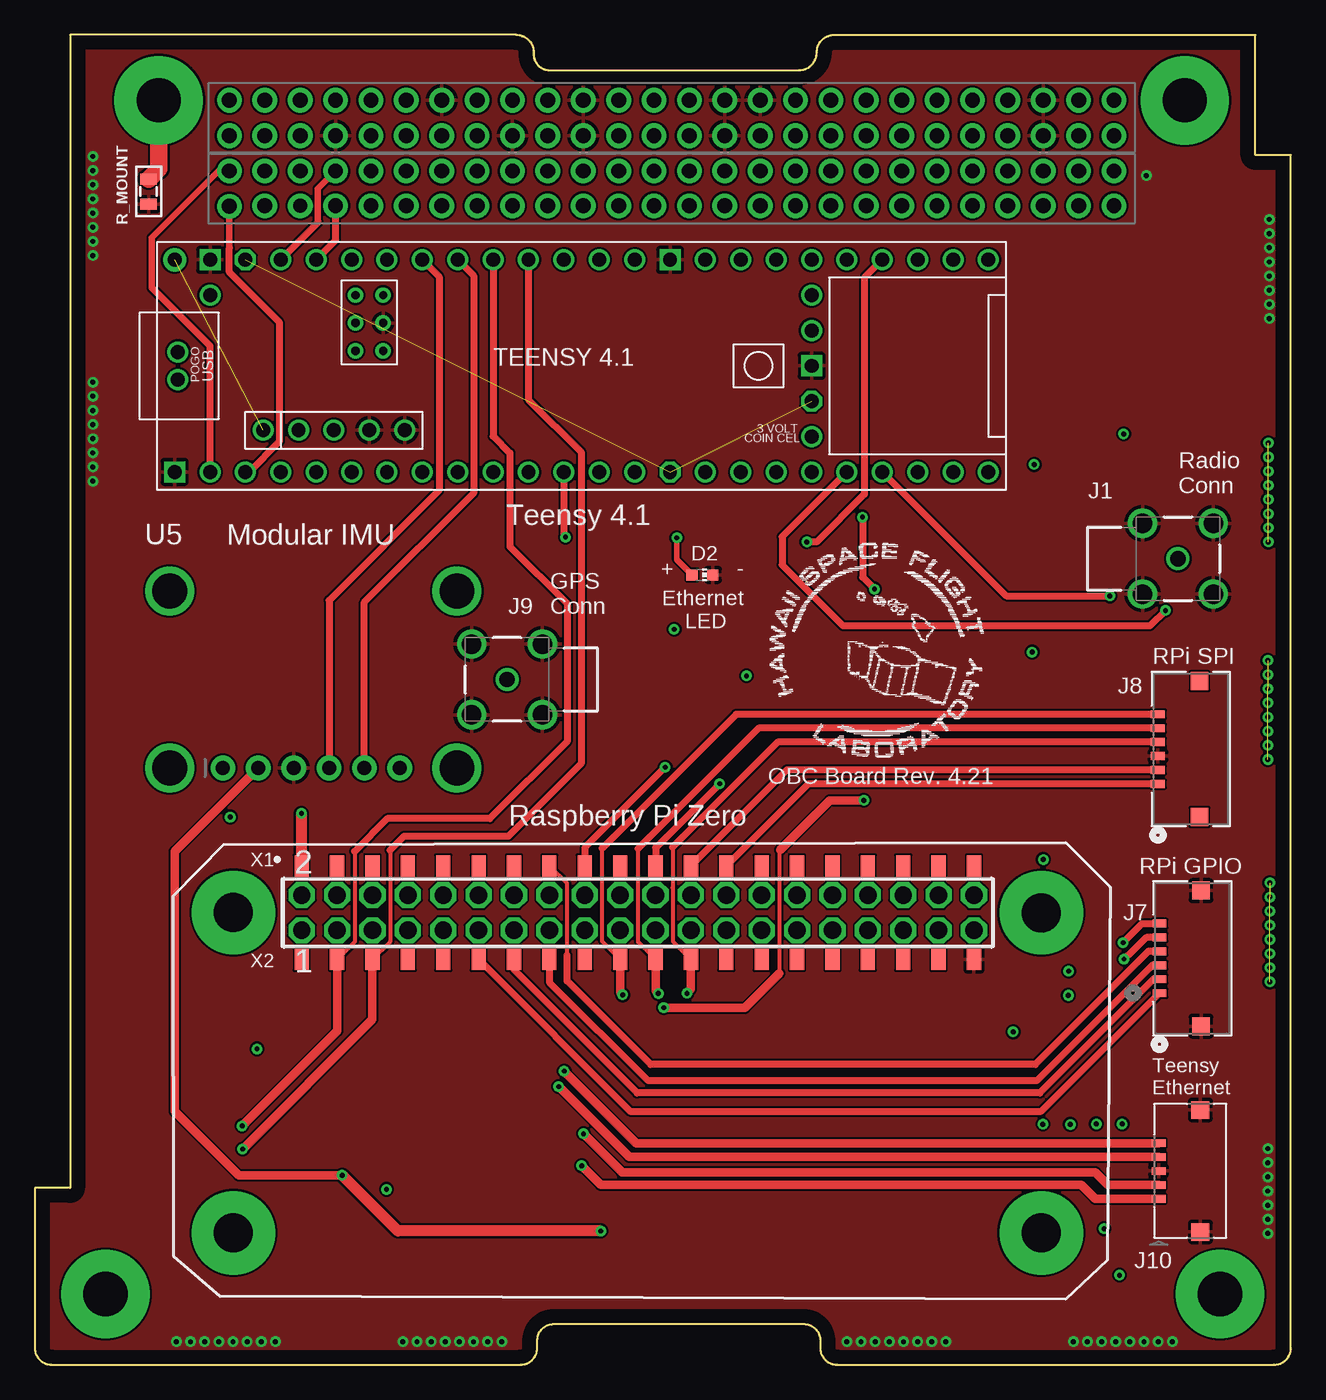
[diagram p3: board, top side]
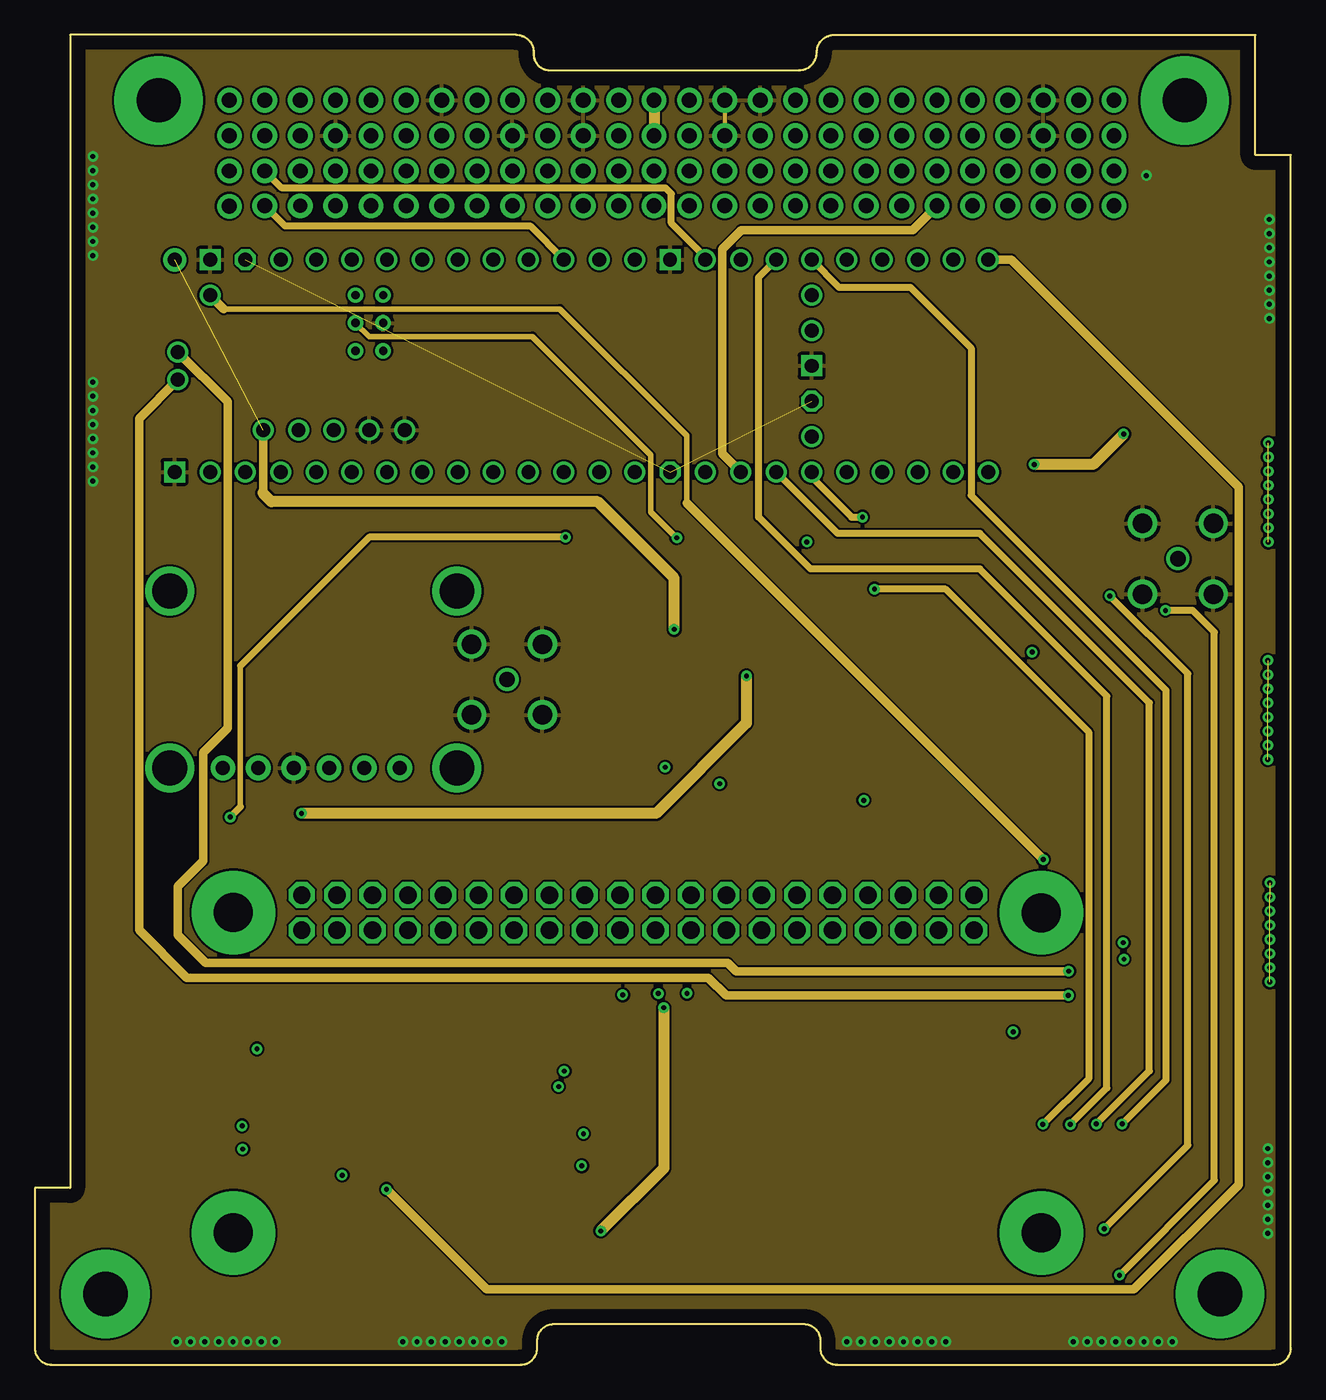
[diagram p4: board, inner layer Route2]
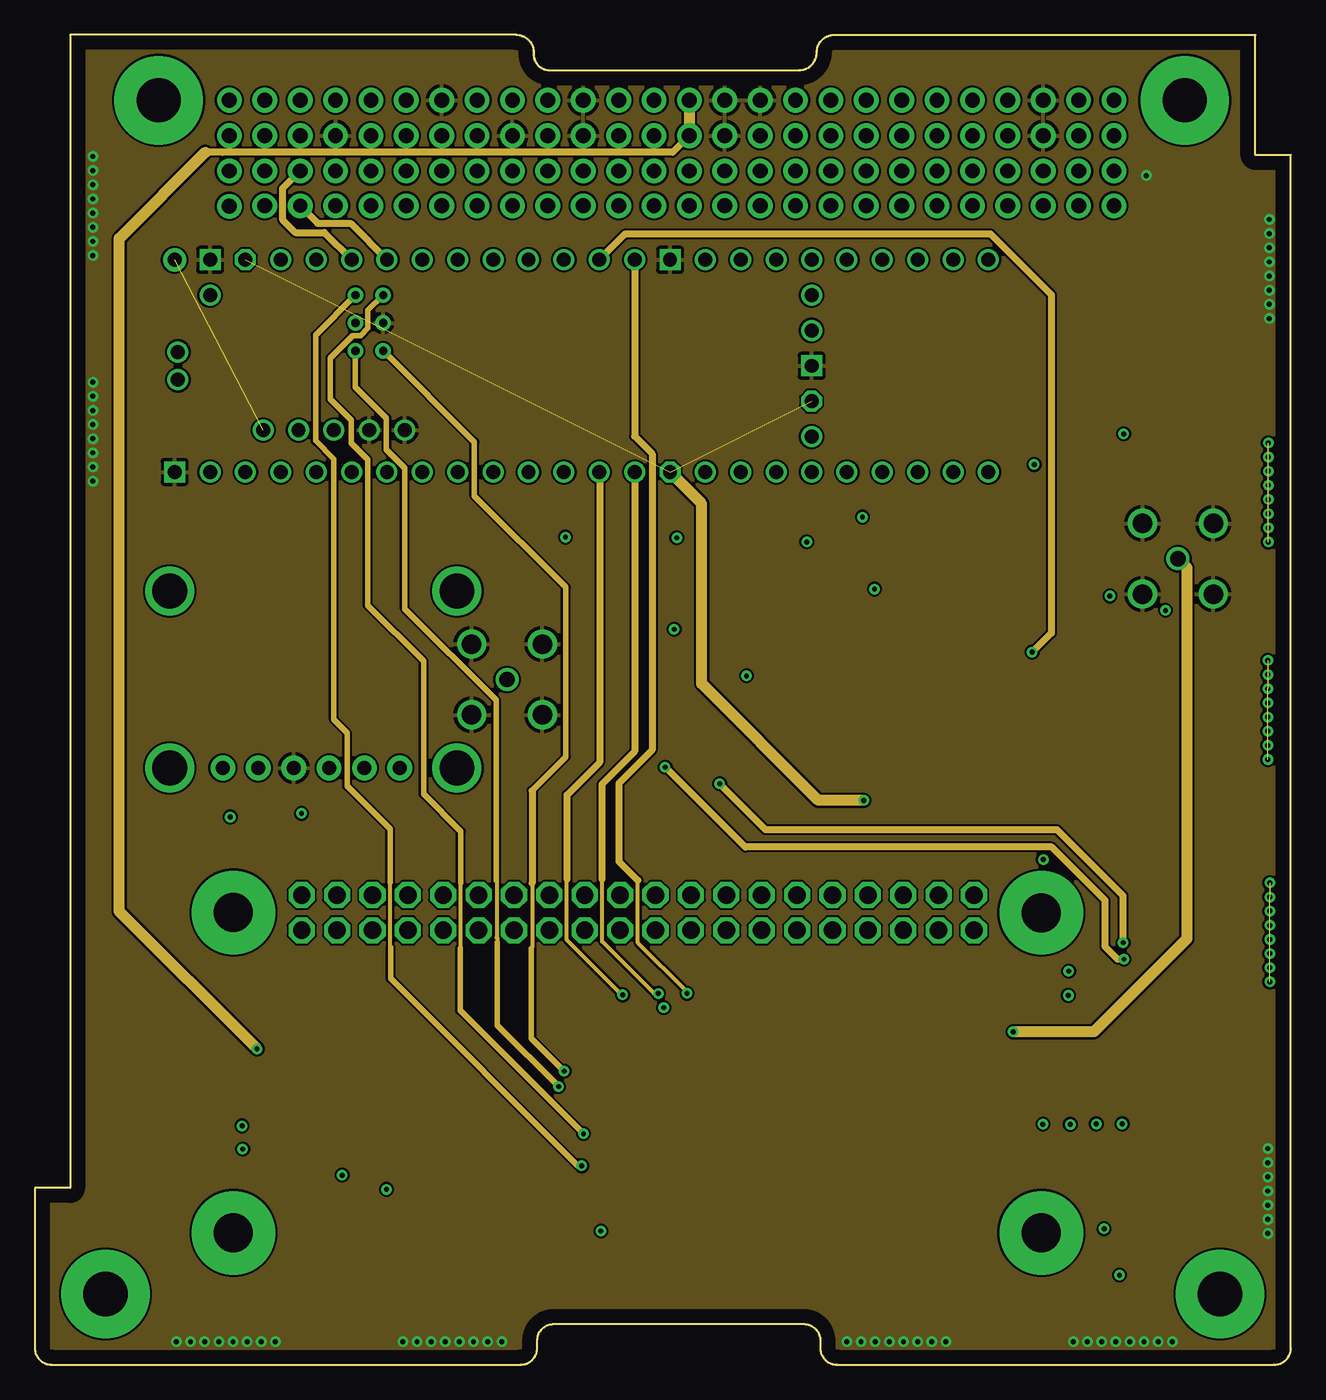
[diagram p5: board, inner layer Route15]
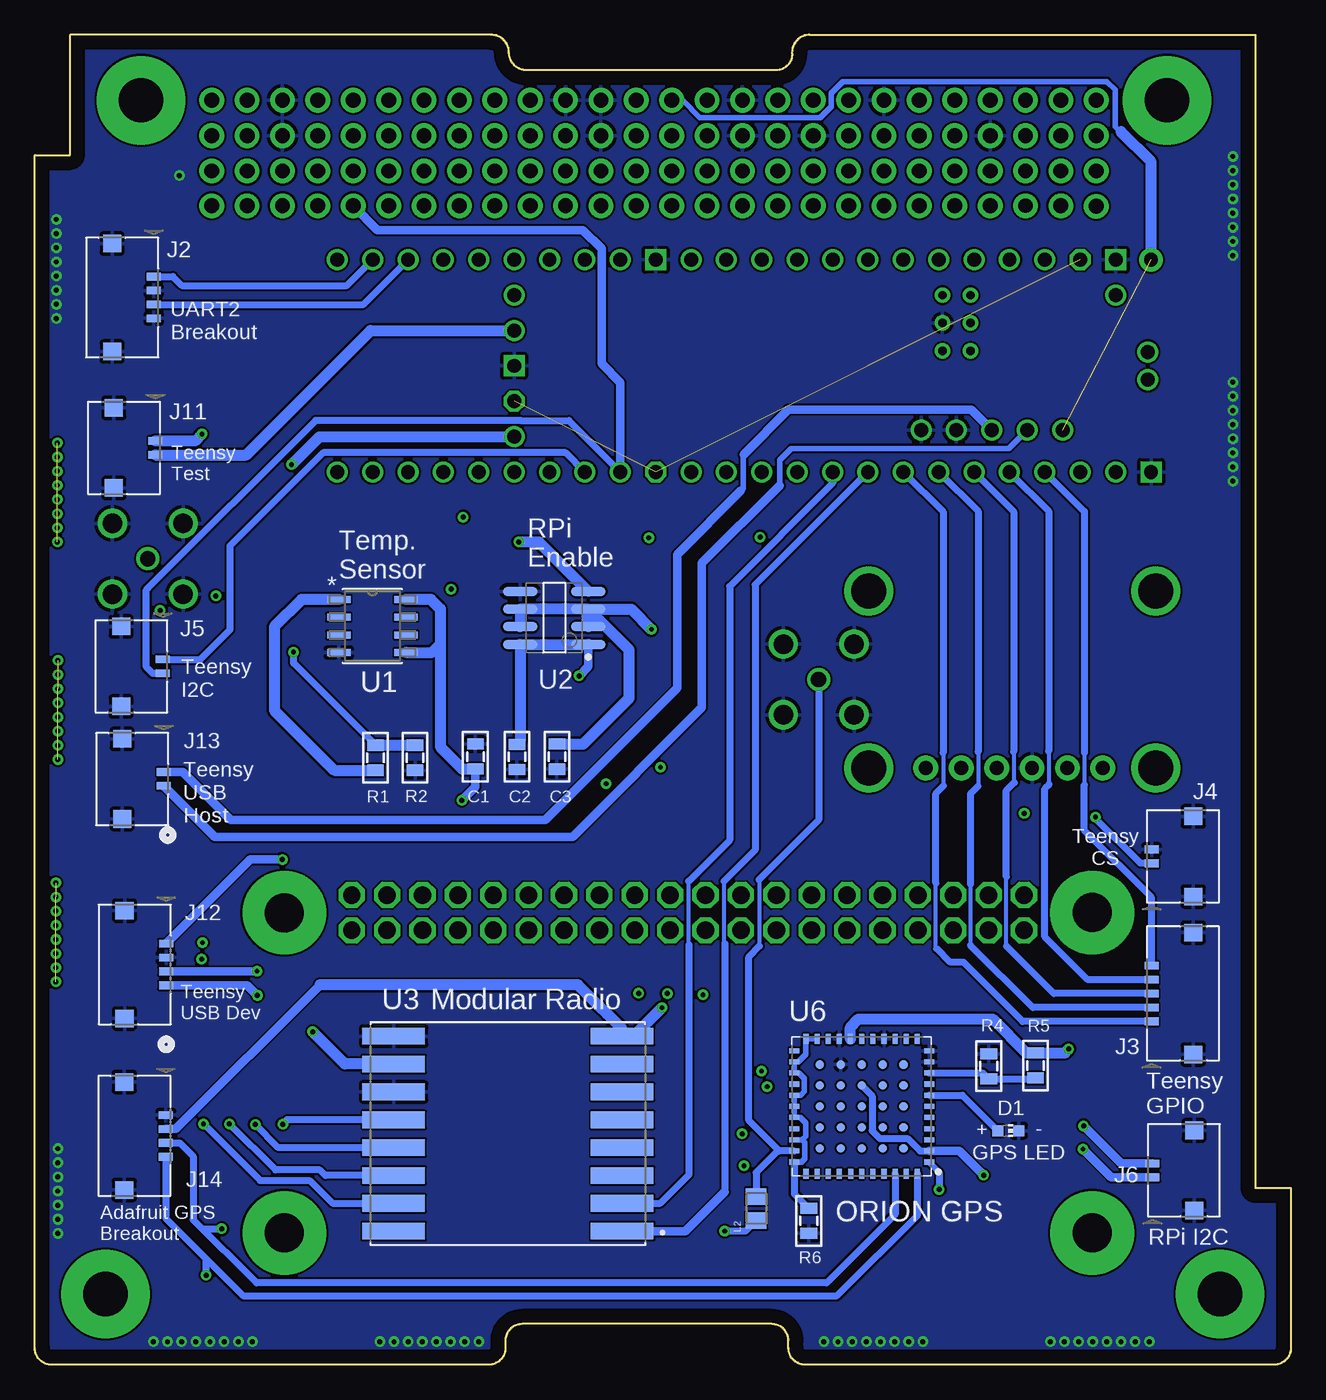
[diagram p6: board, bottom side, seen from below]

Size 90.17 x 95.5 mm. Coordinates in mm from the lower left corner, seen from the top.
Copper layers (1+2*15+16): Top 0.035mm / dielectric 1.5mm / Route2 0.035mm / dielectric 0.15mm / Route15 0.035mm / dielectric 0.2mm / Bottom 0.035mm
Design rules "default *": minimum track width 6mil, minimum drill 8mil, track to track 6mil, track to pad 6mil, pad to pad 6mil, via to via 6mil, smd to smd 6mil, copper to edge 40mil, drill to drill 6mil, minimum pad ring 10mil, minimum via ring 8mil, stop-mask expansion 4mil, vias tented up to drill 0mil, thermal gap 10mil

### Footprints (pad centres in the part's own frame; a part is rotated, then mirrored left to right if it is on the bottom)
0805 = smd 0.8 x 1.2: 1 -0.9,0; 2 0.9,0
CHIP-LED0603 = smd 0.8 x 0.8: A 0,-0.75; C 0,0.75
PC104_WCONN = drill 1.067 pad 1.778: 1.1 13.97,83.185; 1.2 13.97,85.725; 1.3 16.51,83.223; 1.4 16.51,85.725; 1.6 19.05,85.725; 1.7 21.59,83.223; 1.8 21.59,85.725; 1.9 24.13,83.223; 1.10 24.13,85.725; 1.11 26.67,83.223; 1.12 26.67,85.725; 1.13 29.21,83.223; 1.14 29.21,85.725; 1.15 31.75,83.223; 1.16 31.75,85.725; 1.17 34.29,83.223; 1.18 34.29,85.725; 1.19 36.83,83.223; 1.20 36.83,85.725; 1.21 39.37,83.223; 1.22 39.37,85.725; 1.23 41.91,83.223; 1.24 41.91,85.725; 1.25 44.45,83.223; 1.26 44.45,85.725; 1.27 46.99,83.223; 1.28 46.99,85.725; 1.29 49.53,83.223; 1.30 49.53,85.725; 1.31 52.07,83.223; 1.32 52.07,85.725; 1.33 54.61,83.223; 1.34 54.61,85.725; 1.35 57.15,83.223; 1.36 57.15,85.725; 1.37 59.69,83.223; 1.38 59.69,85.725; 1.39 62.23,83.223; 1.40 62.23,85.725; 1.41 64.77,83.223; 1.42 64.77,85.725; 1.43 67.31,83.223; 1.44 67.31,85.725; 1.45 69.85,83.223; 1.46 69.85,85.725; 1.47 72.39,83.223; 1.48 72.39,85.725; 1.49 74.93,83.223; 1.50 74.93,85.725; 1.51 77.47,83.223; 1.52 77.47,85.725; 2.1 13.97,88.265; 2.2 13.97,90.805; 2.3 16.51,88.265; 2.4 16.51,90.805; 2.5 19.05,88.265; 2.6 19.05,90.805; 2.7 21.59,88.265; 2.8 21.59,90.805; 2.9 24.13,88.265; 2.10 24.13,90.805; 2.11 26.67,88.265; 2.12 26.67,90.805; 2.13 29.21,88.265; 2.14 29.21,90.805; 2.15 31.75,88.265; 2.16 31.75,90.805; 2.17 34.29,88.265; 2.18 34.29,90.805; 2.19 36.83,88.265; 2.20 36.83,90.805; 2.21 39.37,88.265; 2.22 39.37,90.805; 2.23 41.91,88.265; 2.24 41.91,90.805; 2.25 44.45,88.265; 2.26 44.45,90.805; 2.27 46.99,88.265; 2.28 46.99,90.805; 2.29 49.53,88.265; 2.30 49.53,90.805; 2.31 52.07,88.265; 2.32 52.07,90.805; 2.33 54.61,88.265; 2.34 54.61,90.805; 2.35 57.15,88.265; 2.36 57.15,90.805; 2.37 59.69,88.265; 2.38 59.69,90.805; 2.39 62.23,88.265; 2.40 62.23,90.805; 2.41 64.77,88.265; 2.42 64.77,90.805; 2.43 67.31,88.265; 2.44 67.31,90.805; 2.45 69.85,88.265; 2.46 69.85,90.805; 2.47 72.39,88.265; 2.48 72.39,90.805; 2.49 74.93,88.265; 2.50 74.93,90.805; 2.51 77.47,88.265; 2.52 77.47,90.805 | drill 1.016 pad 1.778: 1.5 19.05,83.223 | drill 3.175 pad 6.35: P$1 5.08,5.08; P$2 85.09,5.08; P$3 82.55,90.805; P$4 8.89,90.805
SAMTEC_MCX-J-P-H-RA-TH1 = drill 1.1: 1 0,0 | drill 1.4: S1 -2.54,2.54; S2 2.54,2.54; S3 2.54,-2.54; S4 -2.54,-2.54
CON_5037630491 = smd 0.55 x 1: 1 0,0; 2 -1,0; 3 -2,0; 4 -3,0 | smd 1.26 x 1.3: 5 2.375,2.99; 6 -5.38,2.99
CON_5037630591 = smd 0.55 x 1: 1 0,0; 2 -1,0; 3 -2,0; 4 -3,0; 5 -4,0 | smd 1.26 x 1.3: 6 2.375,2.99; 7 -6.38,2.99
CON_5037630291 = smd 0.55 x 1: 1 0,0; 2 -1,0 | smd 1.26 x 1.3: 3 2.375,2.99; 4 -3.38,2.99
CONN_503763-0691_MOL = smd 0.559 x 0.991: 1 2.5,-2.368; 2 1.5,-2.368; 3 0.5,-2.368; 4 -0.5,-2.368; 5 -1.5,-2.368; 6 -2.5,-2.368 | smd 1.295 x 1.27: 7 -4.875,0.622; 8 4.875,0.622
INDC2012X105N = smd 1.2 x 1.47: 1 -0.86,0; 2 0.86,0
R_8_ADI-L = smd 1.676 x 0.508: 1 -2.413,1.905; 2 -2.413,0.635; 3 -2.413,-0.635; 4 -2.413,-1.905; 5 2.413,-1.905; 6 2.413,-0.635; 7 2.413,0.635; 8 2.413,1.905
LINEAR_TECHNOLOGY_LTC1477CS8_2 = smd 2.5 x 0.7: 1 -2.45,1.905; 2 -2.45,0.635; 3 -2.45,-0.635; 4 -2.45,-1.905; 5 2.45,-1.905; 6 2.45,-0.635; 7 2.45,0.635; 8 2.45,1.905
RFM69HCW_433 = smd 4.5 x 1.2: 1 8.2,7; 2 8.2,5; 3 8.2,3; 4 8.2,1; 5 8.2,-1; 6 8.2,-3; 7 8.2,-5; 8 8.2,-7; 9 -8.2,7; 10 -8.2,5; 11 -8.2,3; 12 -8.2,1; 13 -8.2,-1; 14 -8.2,-3; 15 -8.2,-5; 16 -8.2,-7
1X06_ROUND_70 = drill 1 pad 1.778: 1 -6.35,0; 2 -3.81,0; 3 -1.27,0; 4 1.27,0; 5 3.81,0; 6 6.35,0
ORION_A38L = smd 0.7 x 0.36: 1 -4.84,4; 2 -4.84,3.2; 3 -4.84,2.4; 4 -4.84,1.6; 5 -4.84,0.8; 6 -4.84,0; 7 -4.84,-0.8; 8 -4.84,-1.6; 9 -4.84,-2.4; 10 -4.84,-3.2; 11 -4.84,-4; 23 4.84,-4; 24 4.84,-3.2; 25 4.84,-2.4; 26 4.84,-1.6; 27 4.84,-0.8; 28 4.84,0; 29 4.84,0.8; 30 4.84,1.6; 31 4.84,2.4; 32 4.84,3.2; 33 4.84,4 | smd 0.36 x 0.7: 12 -4,-4.84; 13 -3.2,-4.84; 14 -2.4,-4.84; 15 -1.6,-4.84; 16 -0.8,-4.84; 17 0,-4.84; 18 0.81,-4.84; 19 1.6,-4.84; 20 2.4,-4.84; 21 3.2,-4.84; 22 4,-4.84; 34 4,4.84; 35 3.2,4.84; 36 2.4,4.84; 37 1.6,4.84; 38 0.8,4.84; 39 0,4.84; 40 -0.8,4.84; 41 -1.6,4.84; 42 -2.4,4.84; 43 -3.18,4.84; 44 -4,4.84 | smd 0.6 x 0.6: 45 -3,3; 46 -3,1.5; 47 -3,0; 48 -3,-1.5; 49 -3,-3; 50 -1.5,3; 51 -1.5,1.5; 52 -1.5,0; 53 -1.5,-1.5; 54 -1.5,-3; 55 0,3; 56 0,1.5; 57 0,0; 58 0,-1.5; 59 0,-3; 60 1.5,3; 61 1.5,1.5; 62 1.5,0; 63 1.5,-1.5; 64 1.5,-3; 65 3,3; 66 3,1.5; 67 3,0; 68 3,-1.5; 69 3,-3
TEENSY41 = drill 1: 0-RX1/CS1/CRX2 -27.94,-7.62; 1-TX1/MISO1/CTX2 -25.4,-7.62; 2-OUT2 -22.86,-7.62; 3-LRCLK2 -20.32,-7.62; 4-BCLK2 -17.78,-7.62; 5-IN2 -15.24,-7.62; 6-OUT1D -12.7,-7.62; 7-RX2/OUT1A -10.16,-7.62; 8-TX2/IN1 -7.62,-7.62; 9-OUT1C -5.08,-7.62; 10-CS\MQSR -2.54,-7.62; 11-MOSI/CTX1 0,-7.62; 12-MISO/MQSL 2.54,-7.62; 13-SCK/LED 2.54,7.62; 14-A0/TX3/SPDIF_OUT 0,7.62; 15-A1/RX3/SPDIF_IN -2.54,7.62; 16-A2/RX4/SCL1 -5.08,7.62; 17-A3/TX4/SDA1 -7.62,7.62; 18-A4/SDA0 -10.16,7.62; 19-A5/SCL0 -12.7,7.62; 20-A6/TX5/LRCLK1 -15.24,7.62; 21-A7/RX5/BCLK1 -17.78,7.62; 22-A8/CTX1 -20.32,7.62; 23-A9/CRX1/MCLK1 -22.86,7.62; 24-A10/TX6/SCL2 7.62,-7.62; 25-A11/RX6/SDA2 10.16,-7.62; 26-A12/MOSI1 12.7,-7.62; 27-A13/SCK1 15.24,-7.62; 28-RX7 17.78,-7.62; 29-TX7 20.32,-7.62; 30-CRX3 22.86,-7.62; 31-CTX3 25.4,-7.62; 32-OUT1B 27.94,-7.62; 33-MCLK2 27.94,7.62; 34-RX8 25.4,7.62; 35-TX8 22.86,7.62; 36-PWM 20.32,7.62; 37-PWM 17.78,7.62; 38-A14/CS/IN1 15.24,7.62; 39-A15/CS/OUT1A 12.7,7.62; 40-A16/CS1 10.16,7.62; 41-A17/MISO1 7.62,7.62; +5V -24.13,-4.62; D+ -30.25,-1; D- -30.25,1; DM -21.59,-4.62; DP -19.05,-4.62; GND4 -16.51,-4.62; GND5 -13.97,-4.62; ON/OFF 15.24,5.08; PROGRAM 15.24,2.54; VBAT 15.24,-5.08; VUSB -27.94,5.08 | drill 1 octagon: 3V3-1 5.08,-7.62; 3V3-2 15.24,-2.54; 3V3-3 -25.4,7.62 | drill 0.6: G -15.51,3.08; LED -17.51,3.08; R+ -17.51,5.08; R- -15.51,5.08; T+ -15.51,1.08; T- -17.51,1.08 | drill 1 square: GND1 -30.48,-7.62; GND2 15.24,0; GND3 5.08,7.62; GND6 -27.94,7.62 | drill 1 pad 1.676: VIN -30.48,7.62
ADAFRUIT_C25582-40G-M36-0A_0 = smd 1.02 x 1.524: 1 -24.13,-3.354; 2 -24.13,3.354; 3 -21.59,-3.354; 4 -21.59,3.354; 5 -19.05,-3.354; 6 -19.05,3.354; 7 -16.51,-3.354; 8 -16.51,3.354; 9 -13.97,-3.354; 10 -13.97,3.354; 11 -11.43,-3.354; 12 -11.43,3.354; 13 -8.89,-3.354; 14 -8.89,3.354; 15 -6.35,-3.354; 16 -6.35,3.354; 17 -3.81,-3.354; 18 -3.81,3.354; 19 -1.27,-3.354; 20 -1.27,3.354; 21 1.27,-3.354; 22 1.27,3.354; 23 3.81,-3.354; 24 3.81,3.354; 25 6.35,-3.354; 26 6.35,3.354; 27 8.89,-3.354; 28 8.89,3.354; 29 11.43,-3.354; 30 11.43,3.354; 31 13.97,-3.354; 32 13.97,3.354; 33 16.51,-3.354; 34 16.51,3.354; 35 19.05,-3.354; 36 19.05,3.354; 37 21.59,-3.354; 38 21.59,3.354; 39 24.13,-3.354; 40 24.13,3.354
SSW-120-02-G-D = drill 1.25 pad 1.4 octagon: 1 -24.13,-1.27; 2 -24.13,1.27; 3 -21.59,-1.27; 4 -21.59,1.27; 5 -19.05,-1.27; 6 -19.05,1.27; 7 -16.51,-1.27; 8 -16.51,1.27; 9 -13.97,-1.27; 10 -13.97,1.27; 11 -11.43,-1.27; 12 -11.43,1.27; 13 -8.89,-1.27; 14 -8.89,1.27; 15 -6.35,-1.27; 16 -6.35,1.27; 17 -3.81,-1.27; 18 -3.81,1.27; 19 -1.27,-1.27; 20 -1.27,1.27; 21 1.27,-1.27; 22 1.27,1.27; 23 3.81,-1.27; 24 3.81,1.27; 25 6.35,-1.27; 26 6.35,1.27; 27 8.89,-1.27; 28 8.89,1.27; 29 11.43,-1.27; 30 11.43,1.27; 31 13.97,-1.27; 32 13.97,1.27; 33 16.51,-1.27; 34 16.51,1.27; 35 19.05,-1.27; 36 19.05,1.27; 37 21.59,-1.27; 38 21.59,1.27; 39 24.13,-1.27; 40 24.13,1.27

### Placement (x,y rotation side)
C1  58.54,43.67 90 bottom
C2  55.56,43.65 270 bottom
C3  52.69,43.67 270 bottom
D1  20.28,16.8 270 bottom
D2  47.93,56.72 270 top
H1  0,0 0 top
J1  82.06,57.88 270 top
J2  81.63,78.14 90 bottom
J3  10,24.65 270 bottom
J4  10,36 270 bottom
J5  80.98,50.65 90 bottom
J6  9.94,13.45 270 bottom
J7  83.1,29.18 270 top
J8  82.99,44.21 270 top
J9  33.9,49.21 90 top
J10  80.68,11.91 270 top
J11  81.51,66.34 90 bottom
J12  80.74,30.24 90 bottom
J13  80.91,42.57 90 bottom
J14  80.76,17.93 90 bottom
L2  38.39,11.21 90 bottom
R1  65.71,43.59 270 bottom
R2  62.88,43.59 90 bottom
R4  21.69,21.43 270 bottom
R5  18.33,21.49 270 bottom
R6  34.61,10.33 270 bottom
R_MOUNT  8.17,84.24 270 top
U1  65.93,53.05 0 bottom
U2  52.88,53.63 180 bottom
U3  56.21,16.59 180 bottom
U5  19.85,42.86 0 top
U6  30.81,18.55 180 bottom
U$1  40.52,71.73 0 top
X1  43.29,32.46 0 top
X2  43.29,32.46 0 top

### Tracks (layer width: path | path; a pad name or v marks a point on that pad's centre or on a via)
3V3_BUS  (via drill 0.35)
  Route15 0.5: 12.25,87.07 13.46,87.07 13.47,87.06 45.79,87.06 H1.2.27
  Route15 0.8: H1.2.28 H1.2.27 | v15.95,22.67 6.06,32.56 6.06,80.88 12.25,87.07
  Bottom 0.8: U6.18 31.62,24.24 31.04,24.82 21.41,24.82 18.98,22.39 R5.1 16.23,22.39 v15.95,22.67
5V_BUS  (via drill 0.35)  (1 unrouted)
  Route2 0.6: U$1.+5V 16.39,62.58 16.37,62.6
  Route2 0.8: H1.2.26 H1.2.25 | v45.9,52.81 45.9,56.49 40.41,61.98 16.99,61.98 16.37,62.6
  Bottom 0.4: H1.2.26 43.67,90.81 42.42,89.56 33.78,89.56 32.99,90.35 32.99,91.32 32.16,92.14 13.21,92.14 12.62,91.55 12.62,88.9 12.27,88.55 12.21,88.55
  Bottom 0.8: U$1.VIN 10.04,86.38 12.21,88.55 | U2.2 U2.3 | U2.3 U2.6 U2.7 | C3.1 50.8,44.57 47.51,47.86 47.51,51.34 U2.3 | U2.3 47.35,54.26 v45.9,52.81
+3V3_VCC  (via drill 0.35)  (2 unrouted)
  Top 0.3: 53.5,36.96 53.43,36.89 53.43,28.11
  Top 0.6: U5.2 10.04,36.86 10.04,18.21 14.64,13.61 v22.06,13.61 | v59.51,40.53 57.07,40.53 53.5,36.96 | v45.15,25.64 50.96,25.64 53.43,28.11
  Top 0.8: v40.64,9.6 26.07,9.6 v22.06,13.61
  Route2 0.8: v45.15,25.64 45.15,14.11 v40.64,9.6
  Route15 0.8: v59.51,40.53 56.25,40.53 47.87,48.91 47.87,61.84 U$1.3V3-1
  Bottom 0.5: U6.58 30.06,19.3 30.06,16.81 29.5,16.25 27.52,16.25 26.61,15.35 U6.2 | v40.64,9.6 39.14,9.6 L2.1
  Bottom 0.6: U6.2 23.8,15.35 v22.06,13.61 | C1.1 58.54,41.5 v59.51,40.53 | J14.2 80.04,16.93 69.68,27.29
  Bottom 0.8: U1.8 61.74,54.95 61.06,54.27 61.06,51.71 | U1.5 61.63,51.14 61.06,51.71 | 61.06,51.71 61.06,44.36 59.47,42.77 C1.1 | v45.15,25.64 47.2,23.59 U3.16 48.01,24.11 49.08,25.18 49.71,25.81 51.19,27.29 69.68,27.29
AIN0  (via drill 0.35)
  Route15 0.5: U$1.14-A0/TX3/SPDIF_OUT 42.39,81.22 68.59,81.22 72.97,76.84 72.97,52.54 v71.6,51.17
  Bottom 0.5: R1.1 71.6,50.38 v71.6,51.17
  Bottom 0.8: R1.1 R2.2
AIN1
  Route2 0.5: H1.1.3 17.95,81.78 35.55,81.78 U$1.15-A1/RX3/SPDIF_IN
AIN2
  Route2 0.5: H1.1.4 17.73,84.5 45.29,84.5 45.7,84.09 45.7,81.96 48.14,79.52 U$1.41-A17/MISO1
AIN3
  Route15 0.5: H1.1.5 20.31,81.96 22.67,81.96 U$1.20-A6/TX5/LRCLK1
AIN4
  Route15 0.5: H1.1.6 17.78,84.45 17.78,82.23 18.7,81.31 20.78,81.31 U$1.21-A7/RX5/BCLK1
AIN5
  Top 0.5: U$1.22-A8/CTX1 21.59,80.74 H1.1.7
AIN6
  Top 0.45: H1.1.8 20.32,84.46 20.32,82.12
  Top 0.5: 20.32,82.12 20.32,82.01 U$1.23-A9/CRX1/MCLK1
DIO0
  Bottom 0.3: 43.23,34.72 43.26,34.69 43.26,30.2 43.21,30.15
  Bottom 0.5: U3.10 45.26,11.59 43.21,13.64 43.21,30.15 | U$1.8-TX2/IN1 32.9,63.3 40.3,55.9 40.3,37.65 43.23,34.72
ETH_RX+  (via drill 0.35)
  Top 0.6: J10.1 76.12,11.91 75.12,12.91 40.64,12.91 v39.26,14.29
  Route15 0.3: 25.55,29.95 25.51,29.99 25.51,34.65
  Route15 0.4: v39.26,14.29 38.99,14.29 25.55,27.73 25.55,29.95 | U$1.R+ 20.15,73.95 20.15,66.35 21.47,65.03 21.47,46.32 22.43,45.36 22.43,41.54 25.51,38.46 25.51,34.65
ETH_RX-  (via drill 0.35)
  Top 0.6: J10.2 77.04,12.91 76.12,13.83 42.12,13.83 42.12,13.86 v39.39,16.59
  Route15 0.3: 30.59,34.6 30.59,29.96 30.54,29.91
  Route15 0.4: v39.39,16.59 30.54,25.44 30.54,29.91 | U$1.R- 23.92,75.72 23.92,74.44 23.39,73.9 22.82,73.9 21.21,72.29 21.21,69.34 22.71,67.84 22.71,66.18 23.9,65 23.9,54.53 27.91,50.52 27.91,40.98 30.59,38.3 30.59,34.6
ETH_TX+  (via drill 0.35)
  Top 0.6: J10.5 43.17,15.91 v38,21.08
  Route15 0.3: 35.7,34.58 35.7,29.98 35.63,29.91
  Route15 0.4: v38,21.08 35.63,23.45 35.63,29.91 | 35.7,41.22 38.13,43.65 38.13,55.83 31.56,62.4 31.56,66.26 U$1.T+
  Route15 0.5: 35.7,41.22 35.7,34.58
ETH_TX-  (via drill 0.35)
  Top 0.6: J10.4 42.66,14.91 v37.6,19.97
  Route15 0.3: 33.21,30.33 33.21,30.63 33.16,30.68 33.16,34.72 33.11,34.77
  Route15 0.4: U$1.T- 23.01,70.22 25.24,67.99 25.24,65.72 26.57,64.39 26.57,54.27 33.11,47.73 33.11,34.77 | v37.6,19.97 33.21,24.36 33.21,30.33
GND  (via drill 0.35)
  Route2 0.305: H1.2.30 H1.2.29
  other vias: 10.16,1.65 12.19,1.65 13.21,1.65 14.22,1.65 15.24,1.65 16.26,1.65 17.27,1.65 11.18,1.65 26.42,1.65 27.43,1.65 28.45,1.65 29.46,1.65 30.48,1.65 31.5,1.65 32.51,1.65 33.53,1.65 4.17,79.65 4.17,81.69 4.17,82.7 4.17,83.72 4.17,84.73 4.17,85.75 4.17,86.77 4.17,80.67 4.17,63.45 4.17,65.48 4.17,66.5 4.17,67.51 4.17,68.53 4.17,69.55 4.17,70.56 4.17,64.47 58.29,1.65 60.33,1.65 61.34,1.65 62.36,1.65 63.37,1.65 64.39,1.65 65.41,1.65 59.31,1.65 74.55,1.65 75.56,1.65 76.58,1.65 77.6,1.65 78.61,1.65 79.63,1.65 80.64,1.65 81.66,1.65 88.52,9.42 88.52,11.46 88.52,12.47 88.52,13.49 88.52,14.5 88.52,15.52 88.52,10.44 88.62,75.13 88.62,77.17 88.62,78.18 88.62,79.2 88.62,80.21 88.62,81.23 88.62,82.25 88.62,76.15 79.8,85.4
  pour Top: 92.52,-5.29 92.52,98.21 -4.78,98.21 -4.78,-5.29
  pour Bottom: -5.78,98.91 -5.78,-6.19 93.22,-6.19 93.22,98.91
  pour Route2: 93.4,98.2 0.6,98.2 -3,98.2 -3,-5.8 93.4,-5.8
  pour Route15: 91.4,97 -3.8,97 -3.8,-3.2 91.4,-3.2
GND1  (via drill 0.35)  (7 unrouted)
  other vias: 88.66,27.49 88.66,29.53 88.66,30.54 88.66,31.56 88.66,32.57 88.66,33.59 88.66,34.61 88.66,28.51
GND2  (via drill 0.35)  (7 unrouted)
  other vias: 88.55,59.08 88.55,61.12 88.55,62.13 88.55,63.15 88.55,64.16 88.55,65.18 88.55,66.2 88.55,60.1
GND3  (via drill 0.35)  (7 unrouted)
  other vias: 88.52,43.46 88.52,45.5 88.52,46.51 88.52,47.53 88.52,48.54 88.52,49.56 88.52,50.58 88.52,44.48
GPIO17
  Top 0.5: X1.11 42.8,18.17 72.21,18.17 79.34,25.3 79.35,25.3 J7.1
GPIO22
  Top 0.5: X1.15 36.94,27.47 43.99,20.42 71.97,20.42 80.23,28.68 J7.3
GPIO23
  Top 0.3: 38.21,29.41 38.21,34.54 X1.16
  Top 0.5: J7.4 79.94,29.68 71.82,21.56 44.21,21.56 38.21,27.56 38.21,29.41
GPIO24  (via drill 0.35)
  Top 0.5: J7.5 79.77,30.68 78.49,29.4 78.47,29.4 v78.19,29.12 | v45.25,42.91 39.48,37.14 X1.18
  Route15 0.5: v78.19,29.12 77.73,29.12 76.83,30.02 76.83,33.35 73.01,37.17 51.01,37.17 45.27,42.91 v45.25,42.91
GPIO25  (via drill 0.35)
  Top 0.5: v78.13,30.31 79.5,31.68 J7.6 | v49.16,41.72 44.56,37.12 X1.22
  Route15 0.5: v78.13,30.31 78.13,33.67 73.39,38.41 52.47,38.41 v49.16,41.72
GPIO27
  Top 0.5: X1.13 34.4,28.36 43.24,19.52 72.14,19.52 80.3,27.68 J7.2
GPS_RSTN  (via drill 0.35)
  Route2 0.6: U$1.33-MCLK2 70.1,79.35 86.42,63.03 86.42,12.93 78.89,5.4 32.44,5.4 v25.25,12.59
  Bottom 0.45: U6.1 25.25,13.83
  Bottom 0.5: 25.25,13.83 v25.25,12.59
I2C1_SCL
  Bottom 0.5: U$1.24-A10/TX6/SCL2 51.83,67.8 55.27,67.8 55.28,67.81 70,67.81 82.05,55.76
  Bottom 0.508: J5.2 81.72,49.65 82.16,50.09 82.16,55.65 82.05,55.76
  Bottom 0.6: H1.1.43 65.58,81.49 50.82,81.49 49.47,80.14 49.47,71.87 48.14,70.54 U$1.24-A10/TX6/SCL2
I2C1_SDA
  Route2 0.6: H1.1.41 63.03,81.48 50.7,81.48 49.34,80.12 49.34,79.86 49.35,79.85 49.35,65.44 U$1.25-A11/RX6/SDA2
  Bottom 0.5: U$1.25-A11/RX6/SDA2 52.06,65.49 69.47,65.49 76.17,58.79 76.17,52.76 78.28,50.65 J5.1
I2C2_SCL
  Top 0.5: U$1.19-A5/SCL0 29.03,78.14 29.03,62.8 21.12,54.89 U5.4
I2C2_SDA
  Top 0.5: U5.5 23.66,54.76 31.54,62.64 31.54,78.17 U$1.18-A4/SDA0
N$1  (via drill 2.5 pad 3.5)
  other vias: 30.31,55.56
N$2  (via drill 2.8 pad 6)
  other vias: 14.26,32.47
N$3  (via drill 2.5 pad 3.5)
  other vias: 9.69,42.86
N$4  (via drill 2.5 pad 3.5)
  other vias: 9.69,55.56
N$5  (via drill 2.8 pad 6)
  other vias: 72.26,32.46
N$6  (via drill 2.8 pad 6)
  other vias: 72.26,9.46
N$7  (via drill 2.8 pad 6)
  other vias: 14.26,9.46
N$8  (via drill 0.35)
  Top 0.4: D2.A 46.09,57.81 v46.09,59.38
  Route2 0.4: U$1.LED 23.99,73.83 35.71,73.83 44.23,65.31 44.23,61.24 v46.09,59.38
N$12  (via drill 0.35)
  Route15 0.8: J1.1 82.7,57.24 82.7,30.59 76.02,23.91 v70.23,23.91
  Bottom 0.8: U3.7 67.91,21.59 v70.23,23.91
N$14  (via drill 2.5 pad 3.5)
  other vias: 30.31,42.86
N$15
  Bottom 0.8: R1.2 68.67,42.69 72.97,46.99 72.97,53 71.02,54.95 U1.1
N$16
  Bottom 0.5: R4.2 18.39,20.53 R5.2
  Bottom 0.508: U6.9 22.11,20.95 R4.2
N$17
  Bottom 0.3: 38.17,34.84 38.18,34.83 38.18,30.09 38.15,30.06
  Bottom 0.5: 36.72,15.35 38.91,17.54 38.91,29.3 38.15,30.06 | J9.1 33.9,39.11 38.17,34.84 | 37.98,14.21 38.39,13.8 L2.2
  Bottom 0.508: 37.98,14.21 36.84,15.35 36.72,15.35 U6.32
N$21
  Bottom 0.5: U6.7 23.58,19.35 D1.A
N$94
  Top 1.27: H1.P$4 8.91,85.88 R_MOUNT.1
RADIO_RESET
  Bottom 0.3: 40.7,34.72 40.72,34.7 40.72,30.3 40.64,30.22
  Bottom 0.5: 40.64,30.22 40.64,12.41 | U$1.7-RX2/OUT1A 38.46,56.01 38.46,36.96 40.7,34.72
  Bottom 0.6: U3.9 43.46,9.59 40.64,12.41
RF_GND
  Bottom 0.4: U6.31 35.1,16.15 | 35.1,16.15 34.91,15.96 34.91,14.8 35.16,14.55 U6.33 | 35.1,16.15 34.84,16.41 34.84,17.37 35.22,17.75 U6.29 U6.28 U6.27 35.2,19.35 34.93,19.62 34.93,20.56 35.32,20.95 U6.25 U6.24 35.35,21.75 34.81,22.29 U6.22 U6.21
  Bottom 0.508: U6.33 35.65,12.27 R6.1
RPI_5V_PWR_IN  (via drill 0.35)
  Top 0.8: v19.14,39.59 19.14,35.83 X1.2
  Route2 0.8: v51.09,49.47 51.09,46.08 44.6,39.59 v19.14,39.59
  Bottom 0.6: U2.1 50.43,50.13 v51.09,49.47
  Bottom 0.8: U2.1 U2.8 55.33,44.78 C2.1
RPI_ENABLE  (via drill 0.35)
  Top 0.5: U$1.36-PWM 59.55,78.06 59.55,62.51 56.13,59.09 v55.42,59.09
  Bottom 0.8: U2.4 53.99,59.09 v55.42,59.09
SCL1_I2C  (via drill 0.35)
  Top 0.3: X1.5 25.51,30.38 25.51,36.96
  Top 0.5: U$1.16-A2/RX4/SCL1 35.44,69.32 39.22,65.54 39.22,43.17 33.99,37.94 26.49,37.94 25.51,36.96
  Top 0.6: X1.5 24.24,24.8 v14.92,15.48
  Bottom 0.6: v14.92,15.48 12.89,13.45 J6.1
SDA1_I2C  (via drill 0.35)
  Top 0.3: X1.3 22.95,30.36 22.95,36.86
  Top 0.5: U$1.17-A3/TX4/SDA1 32.9,66.68 34.11,65.47 34.11,58.75 38.21,54.65 38.21,44.75 32.67,39.21 25.3,39.21 22.95,36.86
  Top 0.6: X1.3 21.7,23.97 v14.88,17.15
  Bottom 0.6: v14.88,17.15 12.18,14.45 J6.2
SPI0_CE0_N
  Top 0.5: J8.2 54,42.71 X1.24
SPI0_CE1_N
  Top 0.5: J8.1 55.54,41.71 X1.26
SPI0_MISO  (via drill 0.35)
  Top 0.3: X1.21 43.31,30.36 43.31,37.06
  Top 0.5: J8.5 51.96,45.71 43.31,37.06
  Top 0.6: X1.21 44.56,26.86 v44.76,26.66
  Route15 0.3: v44.76,26.66 44.45,26.66 40.72,30.39 40.72,34.86
  Route15 0.5: U$1.12-MISO/MQSL 43.06,44.04 40.72,41.7 40.72,34.86
SPI0_MOSI  (via drill 0.35)
  Top 0.3: 40.72,37.09 40.72,30.41 X1.19
  Top 0.5: J8.6 50.34,46.71 40.72,37.09
  Top 0.6: X1.19 42.02,26.74 v42.2,26.56
  Route15 0.3: v42.2,26.56 42.12,26.56 38.19,30.49 38.19,34.83 38.22,34.86
  Route15 0.5: U$1.11-MOSI/CTX1 40.55,64.08 40.55,43.25 38.22,40.92 38.22,34.86
SPI0_SCLK  (via drill 0.35)
  Top 0.3: 45.79,37.17 45.79,34.25 45.8,34.24 45.8,30.41 X1.23
  Top 0.5: J8.4 53.33,44.71 45.79,37.17
  Top 0.6: X1.23 47.1,26.95 v46.82,26.67
  Route15 0.3: v46.82,26.67 46.82,26.76 43.29,30.29 43.29,34.78
  Route15 0.5: U$1.13-SCK/LED 43.06,66.67 44.31,65.42 44.31,44.13 41.93,41.75 41.93,36.14 43.29,34.78
SPI1_CS1  (via drill 0.35)
  Route2 0.5: v78.06,17.29 81.22,20.45 81.22,48.42 67.22,62.42 67.22,73.02 62.86,77.38 57.73,77.38 U$1.38-A14/CS/IN1
  Bottom 0.5: v78.06,17.29 74,13.23 70.44,13.23 68.8,11.59 U3.2
SPI1_D0  (via drill 0.35)
  Route2 0.5: v74.34,17.25 76.96,19.87 76.96,48.02 67.84,57.14 55.69,57.14 51.96,60.87 51.96,78.09 U$1.39-A15/CS/OUT1A
  Bottom 0.5: U3.4 72.68,15.59 v74.34,17.25
SPI1_D1  (via drill 0.35)
  Route2 0.5: v76.2,17.29 80.01,21.1 80.01,47.53 67.85,59.69 57.64,59.69 U$1.26-A12/MOSI1
  Bottom 0.5: U3.3 69.32,13.59 69.71,13.98 72.89,13.98 v76.2,17.29
SPI1_SCLK  (via drill 0.35)
  Top 0.5: v59.42,60.87 59.42,56.56 v60.28,55.7
  Route2 0.5: v72.37,17.27 75.68,20.58 75.68,45.4 65.38,55.7 v60.28,55.7 | U$1.27-A13/SCK1 55.76,63.75 58.64,60.87 v59.42,60.87
  Bottom 0.5: U3.5 72.05,17.59 v72.37,17.27
T_CS  (via drill 0.35)
  Top 0.5: U$1.10-CS\MQSR 37.98,59.55 v38.1,59.43
  Route2 0.4: 14.76,50.19 14.76,40.06
  Route2 0.5: v38.1,59.43 24,59.43 14.76,50.19 | 14.76,40.06 v14.03,39.33
  Bottom 0.5: J4.1 10.79,36 14.03,39.24 v14.03,39.33
T_GPIO2
  Bottom 0.3: 14.83,43.94 14.83,41.65
  Bottom 0.5: J3.5 10,33.54 14.83,38.37 14.83,41.65 | U$1.2-OUT2 14.83,61.28 14.83,43.94
T_GPIO3
  Bottom 0.3: 17.39,44.05 17.39,41.71 17.36,41.68
  Bottom 0.5: J3.4 14.58,27.65 17.66,30.73 17.66,41.38 17.36,41.68 | U$1.3-LRCLK2 17.39,61.3 17.39,44.05
T_GPIO4
  Bottom 0.3: 20.42,30.06 20.42,35.04 | 19.91,44.02 19.91,41.87 19.85,41.81
  Bottom 0.5: J3.3 17.01,26.65 20.42,30.06 | 20.42,35.04 20.42,41.24 19.85,41.81 | U$1.4-BCLK2 19.91,61.28 19.91,44.02
T_GPIO5
  Bottom 0.3: 23,34.5 23,30.12 | 22.46,44.01 22.46,41.56
  Bottom 0.5: J3.2 18.53,25.65 23,30.12 | 22.46,41.56 22.95,41.08 23,41.02 23,34.5 | U$1.5-IN2 22.46,61.29 22.46,44.01
T_GPIO6
  Bottom 0.3: 25.44,29.89 25.48,29.93 25.48,34.58 | 24.96,43.94 24.96,41.63 24.92,41.59
  Bottom 0.5: J3.1 19.26,24.65 23.5,28.89 24.44,28.89 25.44,29.89 | 25.48,34.58 25.48,41.03 24.92,41.59 | U$1.6-OUT1D 24.96,61.25 24.96,43.94
T_PROGRAM
  Bottom 0.8: J11.2 74.99,65.34 66.06,74.27 U$1.PROGRAM
T_VBAT  (via drill 0.35)
  Route2 0.8: v78.17,66.84 75.98,64.65 v71.74,64.65
  Bottom 0.8: U$1.VBAT 69.73,66.65 v71.73,64.65 v71.74,64.65 | v78.17,66.84 78.67,66.34 J11.1
T_VUSB  (via drill 0.35)
  Route2 0.4: 46.81,61.87 46.81,66.71 37.7,75.82 13.57,75.82
  Route2 0.6: v72.4,36.28 46.81,61.87 | U$1.VUSB 13.57,75.82
  Bottom 0.6: J12.1 74.7,36.28 v72.4,36.28
UART2_RXD
  Bottom 0.5: J2.1 80.26,78.14 79.62,77.5 67.77,77.5 U$1.34-RX8
UART2_TXD
  Bottom 0.5: J2.3 66.59,76.14 U$1.35-TX8
UART4_RXD
  Top 0.45: 8.4,77.34 8.4,80.95 13.18,85.72 H1.1.2
  Top 0.5: U$1.0-RX1/CS1/CRX2 12.58,73.16 8.4,77.34
UART4_TXD
  Top 0.45: 13.96,80.19 13.96,83.17 H1.1.1
  Top 0.5: U$1.1-TX1/MISO1/CTX2 15.38,64.11 17.58,66.31 17.58,74.83 13.96,78.45 13.96,80.19
UART5_RXD  (via drill 0.35)
  Top 0.5: U$1.29-TX7 69.74,55.21 v77.18,55.21
  Route2 0.5: v76.76,9.76 82.77,15.77 82.77,49.62 v77.18,55.21
  Bottom 0.5: 78.8,10.42 78.14,9.76 v76.76,9.76
  Bottom 0.508: U6.42 28.41,10.79 33.33,5.87 74.25,5.87 78.8,10.42 78.8,14.97 79.76,15.93 J14.3
UART5_TXD  (via drill 0.35)
  Top 0.5: U$1.28-RX7 53.65,59.46 53.65,57.43 58.03,53.05 80.05,53.05 v81.17,54.17
  Route2 0.5: v77.87,6.43 84.68,13.24 84.68,52.61 83.12,54.17 v81.17,54.17
  Bottom 0.5: v77.87,6.43 77.87,7.61 80.76,10.5
  Bottom 0.508: J14.4 80.76,10.5 75.21,4.95 32.59,4.95 26.8,10.74 26.81,10.75 U6.44
USB_DEV_D+  (via drill 0.35)
  Route2 0.6: v74.19,26.52 49.62,26.52 48.35,27.79 10.91,27.79 7.48,31.22 7.48,67.94 U$1.D+
  Bottom 0.6: J12.4 74.91,27.24 v74.19,26.52
USB_DEV_D-  (via drill 0.35)
  Route2 0.6: v74.22,28.26 50.34,28.26 49.74,28.86 12.26,28.86 10.26,30.86 10.26,34.33 12.1,36.17 12.1,43.97 13.84,45.71 13.84,69.16 U$1.D-
  Bottom 0.6: J12.3 74.24,28.24 v74.22,28.26
USB_HOST_D+
  Bottom 0.4: 39.29,65.37 39.31,65.35 39.31,62.93 39.48,62.76
  Bottom 0.6: J13.1 79.55,42.57 76.1,39.12 53.52,39.12 44.06,48.58 44.06,58.18 39.48,62.76 | U$1.DP 22.95,68.59 36.07,68.59 39.29,65.37
USB_HOST_D-
  Bottom 0.4: U$1.DM 20.25,65.79 35.88,65.79 36.71,64.96 36.71,63.13
  Bottom 0.6: J13.2 77.24,37.9 51.57,37.9 42.28,47.19 42.28,57.56 36.71,63.13

### Text on the board
tPlace: Teensy 4.1 | Raspberry Pi Zero
tNames: Radio / Conn | Modular IMU | + | - | GPS / Conn | Ethernet / LED | RPi SPI | OBC Board Rev. 4.21 | RPi GPIO | J7 | Teensy / Ethernet
bNames: UART2 / Breakout | Teensy / Test | RPi / Enable | Temp. / Sensor | Teensy / I2C | Teensy / USB / Host | Teensy / CS | Modular Radio | Teensy / USB Dev | Teensy / GPIO | - | + | GPS LED | ORION GPS | RPi I2C | Adafruit GPS / Breakout